# Altium project Whitespace_Daughtercard_r4.PrjPcb (part 2 of 2)

## Sheet Whitespace_Daughtercard_uhf.SchDoc: UHF 470-800 MHz Matching, PA Chain, TX/RX Switching
size D; Author: Ryan E. Guerra; Revision: 1.5; SheetNumber: 7; SheetTotal: 10
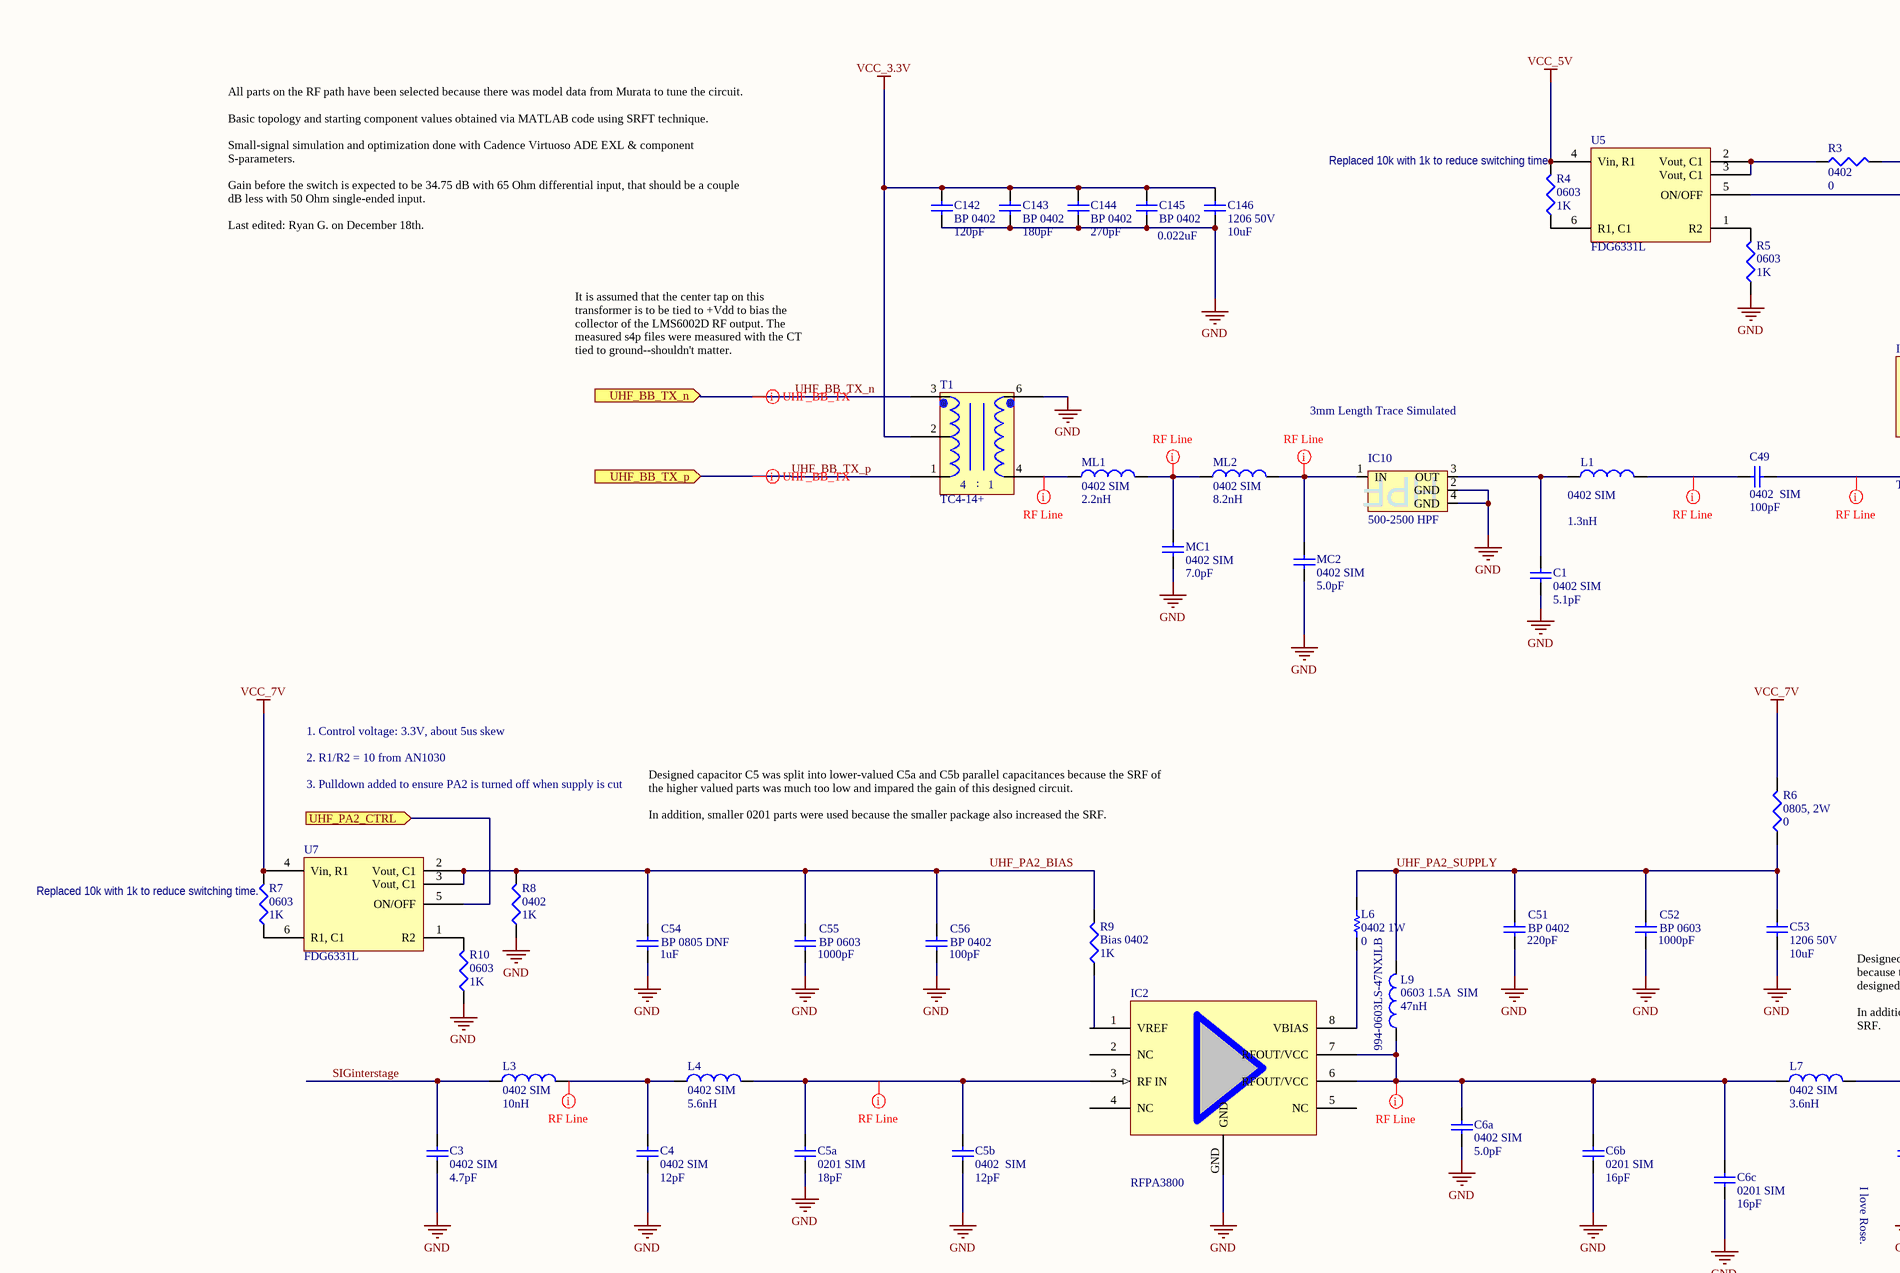
[diagram p8: Whitespace_Daughtercard_uhf.SchDoc, top left]
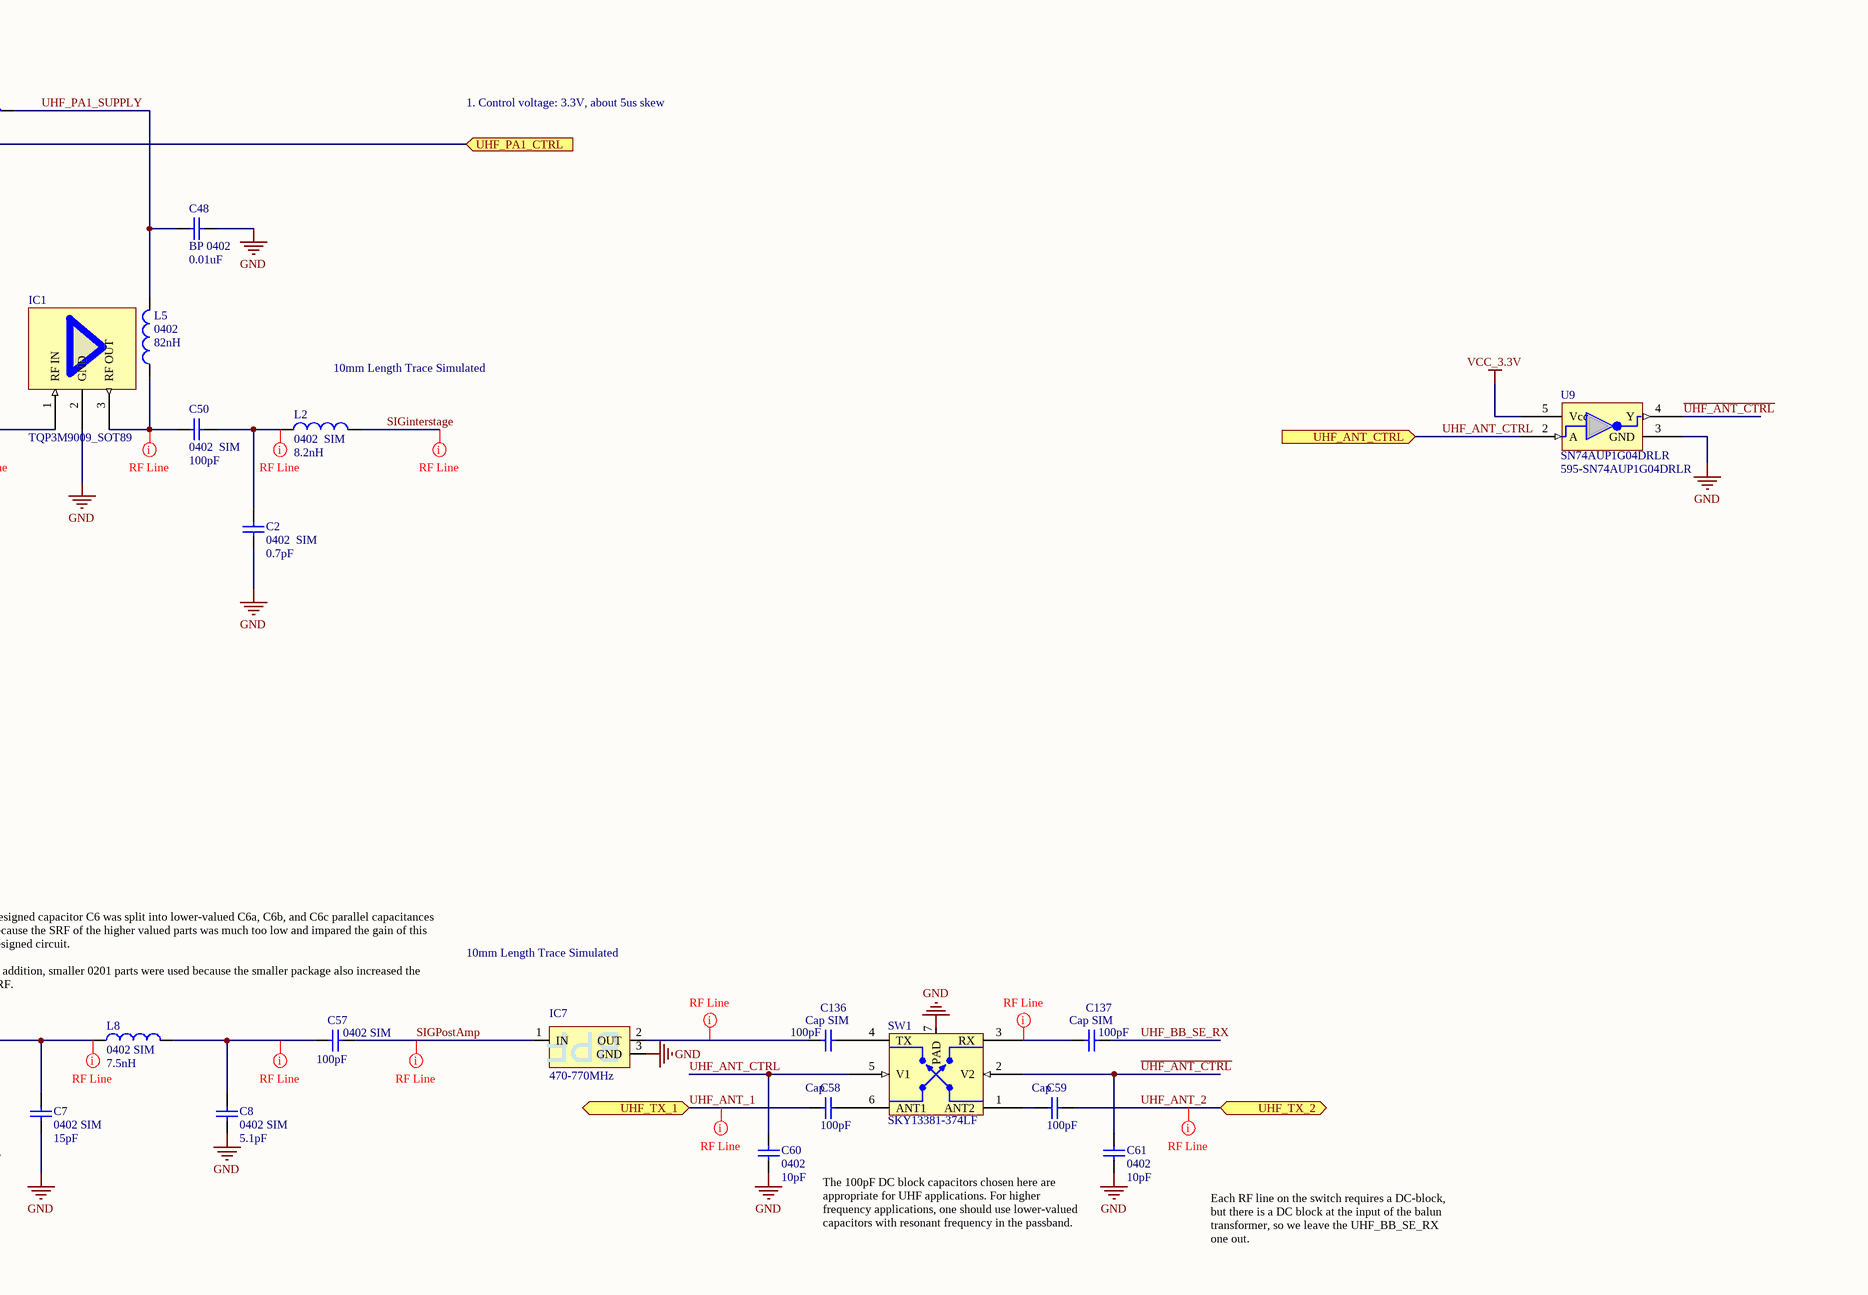
[diagram p9: Whitespace_Daughtercard_uhf.SchDoc, top right]
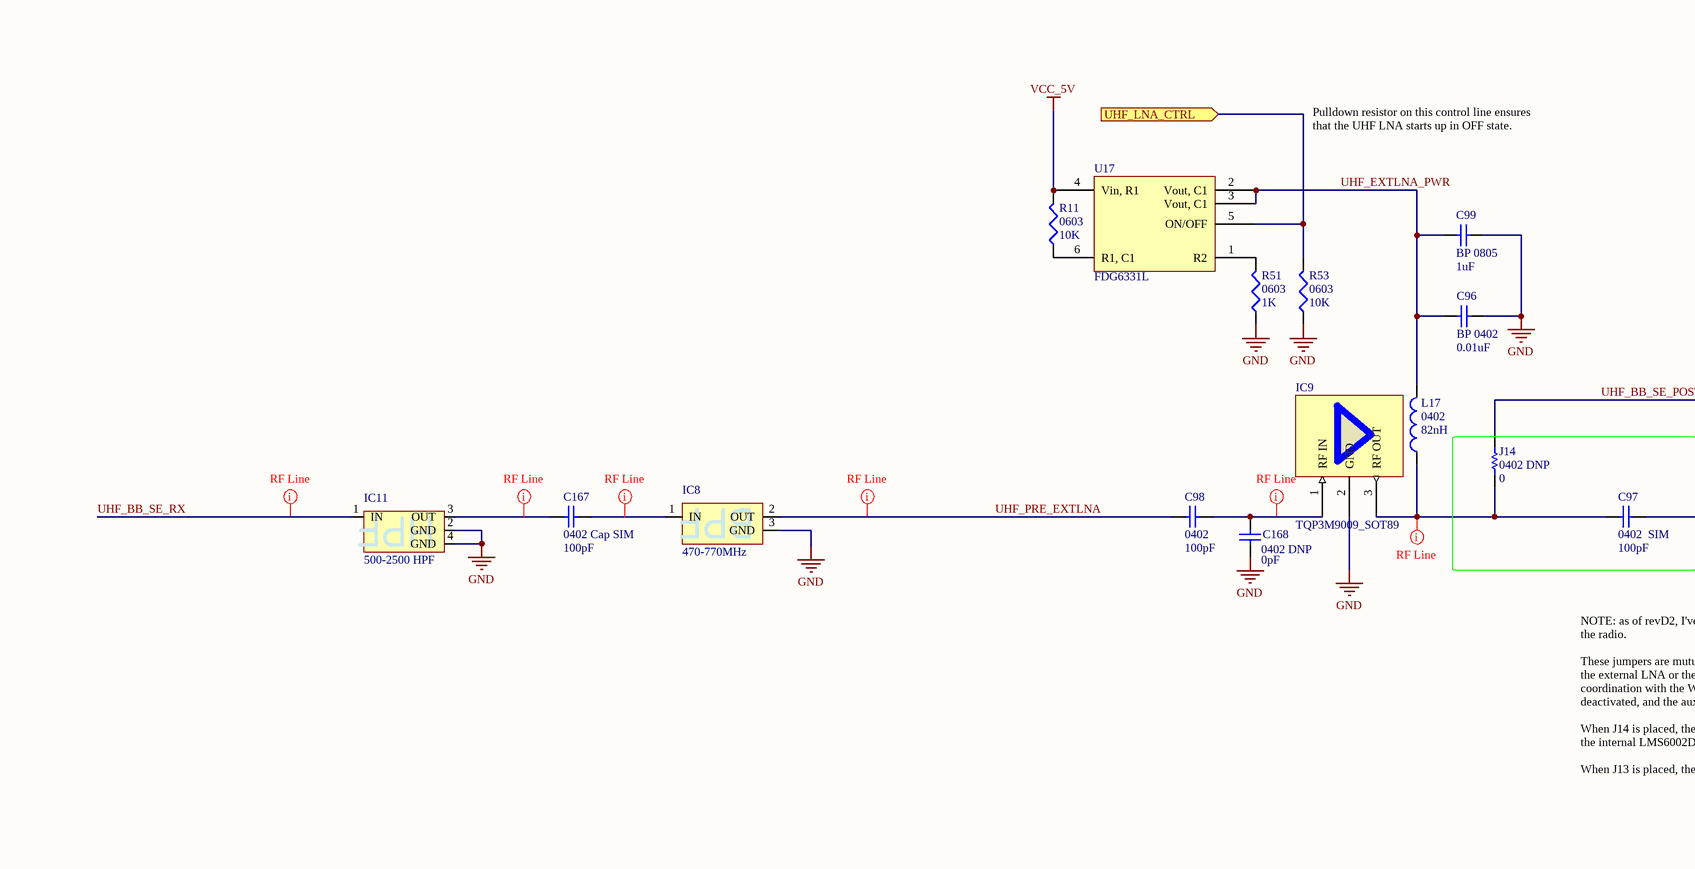
[diagram p10: Whitespace_Daughtercard_uhf.SchDoc, bottom left]
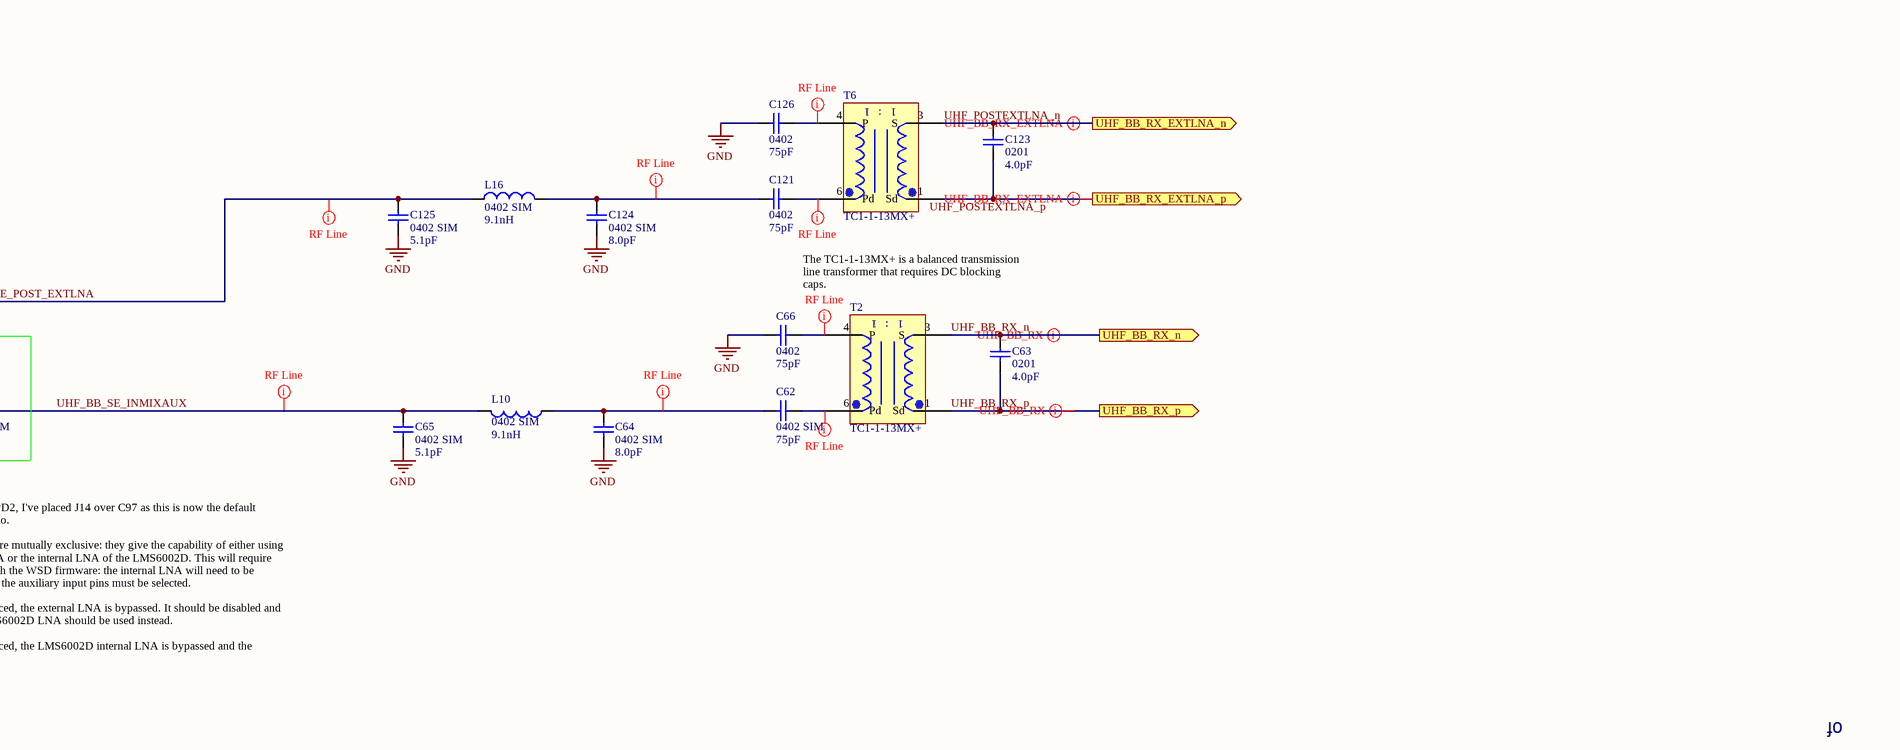
[diagram p11: Whitespace_Daughtercard_uhf.SchDoc, bottom right]

### Parts
C1  0402 SIM  value 5.1pF  [0402_SMT_V3]
C2  0402  SIM  value 0.7pF  [0402_SMT_V3]
C3  0402 SIM  value 4.7pF  [0402_SMT_V3]
C4  0402 SIM  value 12pF  [0402_SMT_V3]
C5a  0201 SIM  value 18pF  [0201_SMT_V3]
C5b  0402  SIM  value 12pF  [0402_SMT_V3]
C6a  0402 SIM  value 5.0pF  [0402_SMT_V3]
C6b  0201 SIM  value 16pF  [0201_SMT_V3]
C6c  0201 SIM  value 16pF  [0201_SMT_V3]
C7  0402 SIM  value 15pF  [0402_SMT_V3]
C8  0402 SIM  value 5.1pF  [0402_SMT_V3]
C48  BP 0402  value 0.01uF  [0402_SMT_V3]
C49  0402  SIM  value 100pF  [0402_SMT_V3]
C50  0402  SIM  value 100pF  [0402_SMT_V3]
C51  BP 0402  value 220pF  [0402_SMT_V3]
C52  BP 0603  value 1000pF  [0603_SMT_V3]
C53  1206 50V  value 10uF  [1206_SMT_v3]
C54  BP 0805 DNF  value 1uF  [0805_SMT_v3]
C55  BP 0603  value 1000pF  [0603_SMT_V3]
C56  BP 0402  value 100pF  [0402_SMT_V3]
C57  0402 SIM  value 100pF  [0402_SMT_V3]
C58  Cap  value 100pF  [0402_SMT_V3]
C59  Cap  value 100pF  [0402_SMT_V3]
C60  0402  value 10pF  [0402_SMT_v3]
C61  0402  value 10pF  [0402_SMT_v3]
C62  0402 SIM  value 75pF  [0402_SMT_v3]
C63  0201  value 4.0pF  [0201_SMT_v3]
C64  0402 SIM  value 8.0pF  [0402_SMT_v3]
C65  0402 SIM  value 5.1pF  [0402_SMT_v3]
C66  0402  value 75pF  [0402_SMT_v3]
C96  BP 0402  value 0.01uF  [0402_SMT_V3]
C97  0402  SIM  value 100pF  [0402_SMT_V3]
C98  0402  value 100pF  [0402_SMT_V3]
C99  BP 0805  value 1uF  [0805_SMT_v3]
C121  0402  value 75pF  [0402_SMT_v3]
C123  0201  value 4.0pF  [0201_SMT_v3]
C124  0402 SIM  value 8.0pF  [0402_SMT_v3]
C125  0402 SIM  value 5.1pF  [0402_SMT_v3]
C126  0402  value 75pF  [0402_SMT_v3]
C136  Cap SIM  value 100pF  [0402_SMT_V3]
C137  Cap SIM  value 100pF  [0402_SMT_V3]
C142  BP 0402  value 120pF  [0402_SMT_v3]
C143  BP 0402  value 180pF  [0402_SMT_v3]
C144  BP 0402  value 270pF  [0402_SMT_v3]
C145  BP 0402  value 0.022uF  [0402_SMT_V3]
C146  1206 50V  value 10uF  [1206_SMT_v3]
C167  0402 Cap SIM  value 100pF  [0402_SMT_V3]
C168  0402 DNP  value 0pF  [0402_SMT_v3]
IC1  TQP3M9009_SOT89  [TQP3M9009_SOT-89_v6]
IC2  RFPA3800  [RFPA3800_SOIC-8_v2]
IC7  470-770MHz  [FI168B/L Taido Yuden]
IC8  470-770MHz  [FI168B/L Taido Yuden]
IC9  TQP3M9009_SOT89  [TQP3M9009_SOT-89_v6]
IC10  500-2500 HPF  [HFCN-440+_v2]
IC11  500-2500 HPF  [HFCN-440+_v2]
J14  0402 DNP  value 0  [0402_SMT_v3]
L1  0402 SIM  value 1.3nH  [0402_SMT_V3]
L2  0402  SIM  value 8.2nH  [0402_SMT_V3]
L3  0402 SIM  value 10nH  [0402_SMT_V3]
L4  0402 SIM  value 5.6nH  [0402_SMT_V3]
L5  0402  value 82nH  [0402_SMT_V3]
L6  0402 1W  value 0  [0402_SMT_v3]
L7  0402 SIM  value 3.6nH  [0402_SMT_V3]
L8  0402 SIM  value 7.5nH  [0402_SMT_V3]
L9  0603 1.5A  SIM  value 47nH  Supplier Part Number 1: 994-0603LS-47NXJLB  [0603_SMT_v3]
L10  0402 SIM  value 9.1nH  [0402_SMT_v3]
L16  0402 SIM  value 9.1nH  [0402_SMT_v3]
L17  0402  value 82nH  [0402_SMT_V3]
MC1  0402 SIM  value 7.0pF  [0402_SMT_V3]
MC2  0402 SIM  value 5.0pF  [0402_SMT_V3]
ML1  0402 SIM  value 2.2nH  [0402_SMT_V3]
ML2  0402 SIM  value 8.2nH  [0402_SMT_V3]
R3  0402  value 0  [0402_SMT_V3]
R4  0603  value 1K  [0603_SMT_v3]
R5  0603  value 1K  [0603_SMT_v3]
R6  0805, 2W  value 0  [0805_SMT_v3]
R7  0603  value 1K  [0603_SMT_v3]
R8  0402  value 1K  [0402_SMT_V3]
R9  Bias 0402  value 1K  [0402_SMT_V3]
R10  0603  value 1K  [0603_SMT_v3]
R11  0603  value 10K  [0603_SMT_v3]
R51  0603  value 1K  [0603_SMT_v3]
R53  0603  value 10K  [0603_SMT_v3]
SW1  SKY13381-374LF  [SKY13381-374LF_v6]
T1  TC4-14+  [AT224-1_V2]
T2  TC1-1-13MX+  [AT1521_MiniCircuits]
T6  TC1-1-13MX+  [AT1521_MiniCircuits]
U5  FDG6331L  [SC-70-6]
U7  FDG6331L  [SC-70-6]
U9  SN74AUP1G04DRLR  Supplier Part Number 1: 595-SN74AUP1G04DRLR  [DRL_R-PDSO-N5_v2]
U17  FDG6331L  [SC-70-6]

### Ports
UHF_ANT_CTRL (in), UHF_BB_RX_EXTLNA_n (out), UHF_BB_RX_EXTLNA_p (out), UHF_BB_RX_n (out), UHF_BB_RX_p (out), UHF_BB_TX_n (in), UHF_BB_TX_p (in), UHF_LNA_CTRL (in), UHF_PA1_CTRL (in), UHF_PA2_CTRL (in), UHF_TX_1 (bidir), UHF_TX_2 (bidir)

### Nets
GND: C1.1 C2.1 C3.1 C4.1 C5a.1 C5b.1 C6a.1 C6b.1 C6c.1 C7.1 C8.1 C48.2 C51.1 C52.1 C53.2 C54.1 C55.1 C56.1 C60.1 C61.1 C64.1 C65.2 C66.2 C96.2 C99.1 C124.1 C125.1 C126.2 C142.1 C143.2 C144.2 C145.1 C146.1 C168.1 IC1.2(GND) IC2.GND IC7.3(GND) IC8.3(GND) IC9.2(GND) IC10.2(GND) IC10.4(GND) IC11.2(GND) IC11.4(GND) MC1.1 MC2.1 R5.1 R8.1 R10.1 R51.1 R53.1 SW1.7(PAD) T1.6(P_DOT) U9.3(GND)
VCC_3.3V: C142.2 C143.1 C144.1 C145.2 C146.2 T1.2(S_CT) U9.5(Vcc)
VCC_5V: R4.2 R11.2 U5.4(Vin,_R1) U17.4(Vin,_R1)
VCC_7V: R6.2 R7.2 U7.4(Vin,_R1)
~{UHF_ANT_CTRL}: C61.2 SW1.2(V2) U9.4(Y)  [project net ~{UHF_ANT_CTRL_7}]
PB5: R53.2 U17.5(ON/OFF) ; port UHF_LNA_CTRL
PE4: U5.5(ON/OFF) ; port UHF_PA1_CTRL
SIGinterstage: C3.2 L2.2 L3.1  [project net SIGinterstage_7]
SIGPostAmp: C57.2 IC7.1(IN)  [project net SIGPostAmp_7]
UHF_ANT_1: C58.2 ; port UHF_TX_1
UHF_ANT_2: C59.1 ; port UHF_TX_2
UHF_ANT_CTRL: C60.2 SW1.5(V1) U9.2(A) ; port UHF_ANT_CTRL
UHF_BB_RX_n: C63.1 T2.3(S) ; port UHF_BB_RX_n
UHF_BB_RX_p: C63.2 T2.1(Sd) ; port UHF_BB_RX_p
UHF_BB_SE_INMIXAUX: C65.1 C97.1 L10.2  [project net UHF_BB_SE_INMIXAUX_7]
UHF_BB_SE_POST_EXTLNA: C125.2 J14.2 L16.1  [project net UHF_BB_SE_POST_EXTLNA_7]
UHF_BB_SE_RX: C137.1 IC11.1(IN)  [project net UHF_BB_SE_RX_7]
UHF_BB_TX_n: T1.3(S_DOT) ; port UHF_BB_TX_n
UHF_BB_TX_p: T1.1(S) ; port UHF_BB_TX_p
UHF_EXTLNA_PWR: C96.1 C99.2 L17.2 U17.2(Vout,_C1) U17.3(Vout,_C1)  [project net UHF_EXTLNA_PWR_7]
UHF_PA1_SUPPLY: C48.1 L5.2 R3.2  [project net UHF_PA1_SUPPLY_7]
UHF_PA2_BIAS: C54.2 C55.2 C56.2 R8.2 R9.2 U7.2(Vout,_C1) U7.3(Vout,_C1)  [project net UHF_PA2_BIAS_7]
UHF_PA2_CTRL: U7.5(ON/OFF) ; port UHF_PA2_CTRL
UHF_PA2_SUPPLY: C51.2 C52.2 C53.1 L6.2 L9.2 R6.1  [project net UHF_PA2_SUPPLY_7]
UHF_POSTEXTLNA_n: C123.1 T6.3(S) ; port UHF_BB_RX_EXTLNA_n
UHF_POSTEXTLNA_p: C123.2 T6.1(Sd) ; port UHF_BB_RX_EXTLNA_p
UHF_PRE_EXTLNA: C98.2 IC8.2(OUT)  [project net UHF_PRE_EXTLNA_7]
NetC1_2: C1.2 IC10.3(OUT) L1.1
NetC2_2: C2.2 C50.2 L2.1
NetC4_2: C4.2 L3.2 L4.1
NetC5a_2: C5a.2 C5b.2 IC2.3(RF_IN) L4.2
NetC6a_2: C6a.2 C6b.2 C6c.2 IC2.6(RFOUT/VCC) IC2.7(RFOUT/VCC) L7.1 L9.1
NetC7_2: C7.2 L7.2 L8.1
NetC8_2: C8.2 C57.1 L8.2
NetC49_1: C49.1 L1.2
NetC49_2: C49.2 IC1.1(RF_IN)
NetC50_1: C50.1 IC1.3(RF_OUT) L5.1
NetC58_1: C58.1 SW1.6(ANT1)
NetC59_2: C59.2 SW1.1(ANT2)
NetC62_1: C62.1 T2.6(Pd)
NetC62_2: C62.2 C64.2 L10.1
NetC66_1: C66.1 T2.4(P)
NetC97_2: C97.2 IC9.3(RF_OUT) J14.1 L17.1
NetC98_1: C98.1 C168.2 IC9.1(RF_IN)
NetC121_1: C121.1 T6.6(Pd)
NetC121_2: C121.2 C124.2 L16.2
NetC126_1: C126.1 T6.4(P)
NetC136_1: C136.1 SW1.4(TX)
NetC136_2: C136.2 IC7.2(OUT)
NetC137_2: C137.2 SW1.3(RX)
NetC167_1: C167.1 IC11.3(OUT)
NetC167_2: C167.2 IC8.1(IN)
NetIC2_1: IC2.1(VREF) R9.1
NetIC2_8: IC2.8(VBIAS) L6.1
NetIC10_1: IC10.1(IN) MC2.2 ML2.2
NetMC1_2: MC1.2 ML1.2 ML2.1
NetML1_1: ML1.1 T1.4(P)
NetR3_1: R3.1 U5.2(Vout,_C1) U5.3(Vout,_C1)
NetR4_1: R4.1 U5.6(R1,_C1)
NetR5_2: R5.2 U5.1(R2)
NetR7_1: R7.1 U7.6(R1,_C1)
NetR10_2: R10.2 U7.1(R2)
NetR11_1: R11.1 U17.6(R1,_C1)
NetR51_2: R51.2 U17.1(R2)

Not connected (* = marked no-connect by the designer): IC2 2(NC) 4(NC) 5(NC)

### Layout directives
differential pair: UHF_BB_RX_n, UHF_BB_RX_p, UHF_BB_TX_n, UHF_BB_TX_p, UHF_POSTEXTLNA_n, UHF_POSTEXTLNA_p
rule Impedance Constraint [Min = 49.00    Max = 51.00    ]; net class RF: NetC2_2, NetC4_2, NetC5a_2, NetC6a_2, NetC7_2, NetC8_2, NetC49_1, NetC49_2, NetC50_1, NetC62_1, NetC62_2, NetC66_1, NetC97_2, NetC98_1, NetC121_1, NetC121_2, NetC126_1, NetC136_2, NetC137_2, NetC167_1, NetC167_2, NetIC10_1, NetMC1_2, NetML1_1, SIGinterstage_7, SIGPostAmp_7, UHF_ANT_1, UHF_ANT_2, UHF_BB_SE_INMIXAUX_7, UHF_BB_SE_POST_EXTLNA_7, UHF_BB_SE_RX_7, UHF_PRE_EXTLNA_7

### Notes on the sheet
- (near U5) Replaced 10k with 1k to reduce switching time.
- 1. Control voltage: 3.3V, about 5us skew
- All parts on the RF path have been selected because there was model data from Murata to tune the circuit.
  Basic topology and starting component values obtained via MATLAB code using SRFT technique.
  Small-signal simulation and optimization done with Cadence Virtuoso ADE EXL & component S-parameters.
  Gain before the switch is expected to be 34.75 dB with 65 Ohm differential input, that should be a couple dB less with 50 Ohm single-ended input.
  Last edited: Ryan G. on December 18th.
- It is assumed that the center tap on this transformer is to be tied to +Vdd to bias the collector of the LMS6002D RF output. The measured s4p files were measured with the CT tied to ground--shouldn't matter.
- 3mm Length Trace Simulated
- (near L2) 10mm Length Trace Simulated
- 2. R1/R2 = 10 from AN1030
- 3. Pulldown added to ensure PA2 is turned off when supply is cut
- Designed capacitor C5 was split into lower-valued C5a and C5b parallel capacitances because the SRF of the higher valued parts was much too low and impared the gain of this designed circuit.
  In addition, smaller 0201 parts were used because the smaller package also increased the SRF.
- Replaced 10k with 1k to reduce switching time.
- 10mm Length Trace Simulated
- Designed capacitor C6 was split into lower-valued C6a, C6b, and C6c parallel capacitances because the SRF of the higher valued parts was much too low and impared the gain of this designed circuit.
  In addition, smaller 0201 parts were used because the smaller package also increased the SRF.
- (near C7) I love Rose.
- (near C61) The 100pF DC block capacitors chosen here are appropriate for UHF applications. For higher frequency applications, one should use lower-valued capacitors with resonant frequency in the passband.
- Each RF line on the switch requires a DC-block, but there is a DC block at the input of the balun transformer, so we leave the UHF_BB_SE_RX one out.
- Pulldown resistor on this control line ensures that the UHF LNA starts up in OFF state.
- The TC1-1-13MX+ is a balanced transmission line transformer that requires DC blocking caps.
- NOTE: as of revD2, I've placed J14 over C97 as this is now the default mode of the radio.
  These jumpers are mutually exclusive: they give the capability of either using the external LNA or the internal LNA of the LMS6002D. This will require coordination with the WSD firmware: the internal LNA will need to be deactivated, and the auxiliary input pins must be selected.
  When J14 is placed, the external LNA is bypassed. It should be disabled and the internal LMS6002D LNA should be used instead.
  When J13 is placed, the LMS6002D internal LNA is bypassed and the external LNA should be enabled by bringing PB5 on the Stellaris high.
- of
- (in symbol FI168L062005-T) BPF
- (in symbol HFCN-440+) HPF
- (in symbol TC1-1-13MX+) :
- (in symbol TC4-14+) :

### Library data of the parts
C1-C4 C5a C5b C6a C6b C6c C7 C8 C60-C66 C121 C123-C126 MC2 = Cap Semi: Capacitor (Semiconductor SIM Model); Published: 8-Jun-2000; LatestRevisionDate: 29-May-2009; LatestRevisionNote: IPC-7351 Footprint Added.; PackageReference: C1206; Publisher: Altium Limited; PackageDescription: Chip Capacitor; Supplier 1: Mouser
  C1 C8 C65 C125: Supplier Part Number 1: 81-GRM1555C1H5R1WA1D
  C2: Supplier Part Number 1: 81-GRM1555C1HR70WA1D
  C3: Supplier Part Number 1: 81-GRM1555C1H4R7WA1D
  C4 C5b: Supplier Part Number 1: 81-GJM1555C1H120FB1D
  C5a: Supplier Part Number 1: 81-GRM0335C1H180GA1D
  C6a: Supplier Part Number 1: 81-GJM1555C1H5R0BB01
  C6b C6c: Supplier Part Number 1: 81-GRM0335C1H160GA1D
  C7: Supplier Part Number 1: 81-GJM1555C1H150GB01
  C60 C61: Supplier Part Number 1: 81-GRM1555C1H100JA1D
  C62 C66 C121 C126: Supplier Part Number 1: 81-GRM1555C1H750GZ1D
  C63 C123: Supplier Part Number 1: 81-GRM0335C1H4R0CD1D
  C64 C124: Supplier Part Number 1: 81-GRM1555C1H8R0BZ1D
  MC2: Supplier Part Number 1: 81-GRM1555C1H5R0WA1D
C48-C59 C96-C99 C136 C137 C142-C146 C167 MC1 = Cap: Capacitor; Published: 8-Jun-2000; LatestRevisionDate: 17-Jul-2002; LatestRevisionNote: Re-released for DXP Platform.; PackageReference: RAD-0.3; Publisher: Altium Limited; PackageDescription: Radial Cap, Thru-Hole; 2 Leads; 0.3 in Pin Spacing; Supplier 1: Mouser
  C48 C96: Supplier Part Number 1: 81-GRM155R71H103KA8D
  C49 C50 C56-C59 C97 C98 C136 C137 C167: Supplier Part Number 1: 81-GRM1555C1H101GA1D
  C51: Supplier Part Number 1: 81-GRM1555C1H221GA1J
  C52 C55: Supplier Part Number 1: 81-GRM39X102J50D
  C53 C146: Supplier Part Number 1: 81-GRM31CR61H106KA2L
  C54 C99: Supplier Part Number 1: 81-GRM21BR71H105KA2L
  C142: Supplier Part Number 1: 81-GRM1555C1H121GA1D
  C143: Supplier Part Number 1: 81-GRM1555C1H181GA1D
  C144: Supplier Part Number 1: 81-GRM155C1H271JA01D
  C145: Supplier Part Number 1: 81-GRM155R71H223KA2J
  MC1: Supplier Part Number 1: 81-GRM1555C1H7R0WA1D
C168 = Cap_0402: 0402 SMT Cap
IC1 IC9 = TQP3M9009_SOT89: Triquint TQP3M9009 Power Amplifier; Supplier 1: Mouser; Supplier Part Number 1: 772-TQP3M9009
IC2 = RFPA3800: RFMD RFPA3800 Power Amplifier
IC7 IC8 = FI168L062005-T: Supplier 1: Mouser; Supplier Part Number 1: 963-FI168L062005-T
IC10 IC11 = HFCN-440+: Mini-Circuits High-Pass 500-2500 MHz Filter SMT
J14 L6 = Res_0402: 0402 SMT Resistor; Supplier Part Number 1: 660-RK73Z1ETTP; Supplier 1: Mouser
L1-L5 L7-L10 L16 L17 ML1 ML2 = Inductor: Code_IEC: 1005; Published: 8-Jun-2000; LatestRevisionDate: 29-May-2009; LatestRevisionNote: IPC-7351 Footprint Added.; PackageReference: 0402-A; Publisher: Altium Limited; PackageDescription: Chip Inductor; Code_JEITA: 0402; Supplier 1: Mouser
  L1: Supplier Part Number 1: 81-LQP15MN1N3W02D
  L2 ML2: Supplier Part Number 1: 81-LQP15MN8N2B02D
  L3: Supplier Part Number 1: 81-LQP15MN10NG02D
  L4: Supplier Part Number 1: 81-LQP15MN5N6B02D
  L5 L17: Supplier Part Number 1: 81-LQW15AN82NJ00D
  L7: Supplier Part Number 1: 81-LQP15MN3N6W02D
  L8: Supplier Part Number 1: 81-LQP15MN7N5B02D
  L10 L16: Supplier Part Number 1: 81-LQP15MN9N1B02D
  ML1: Supplier Part Number 1: 81-LQP15MN2N2W02D
R3-R11 R51 R53 = Res3: Resistor; Published: 8-Jun-2000; LatestRevisionDate: 29-May-2009; LatestRevisionNote: IPC-7351 Footprint Added.; PackageReference: J1-0603; Publisher: Altium Limited; PackageDescription: Chip Resistor; Supplier 1: Mouser
  R3: Supplier Part Number 1: 660-RK73Z1ETTP
  R4 R5 R7 R10 R51: Supplier Part Number 1: 71-CRCW0603J-1.0K
  R6: Supplier Part Number 1: 660-RK73Z2ATTED
  R8 R9: Supplier Part Number 1: 754-RR0510P-102D
  R11 R53: Supplier Part Number 1: 71-CRCW0603J-10K
SW1 = SKY13381-374LF: GaAs pHEMT DPDT switch 0.1-6.0 GHz; Supplier 1: Mouser; Supplier Part Number 1: 873-SKY13381-374LF
T1 = TC4-14+: Mini-Circuits Type A Transformer, 4:1 Ohm, CT, 200-1400MHz; Manufacturer: Mini-Circuits; Supplier 1: Mini-Circuits; Supplier Part Number 1: TC4-14X+
T2 T6 = TC1-1-13MX+: Mini-Circuits Type G 4.5-3000MHz 1:1 Transformer
U5 U7 U17 = FDG6331L: Integrated Load Switch, 0.8A, 2.5-8V, SC70-6; Supplier 1: Mouser; Supplier Part Number 1: 512-FDG6331L
U9 = SN74AUP1G04DRLR: Inverters Lo Pwr Sngl Invter Gate; Supplier 1: Mouser

## Sheet Whitespace_Daughtercard_wifi.SchDoc: Wifi 2.4GHz Matching, PA Chain, TX/RX Switching
size A3; Author: Ryan E. Guerra; Revision: 1.1; SheetNumber: 8; SheetTotal: 10
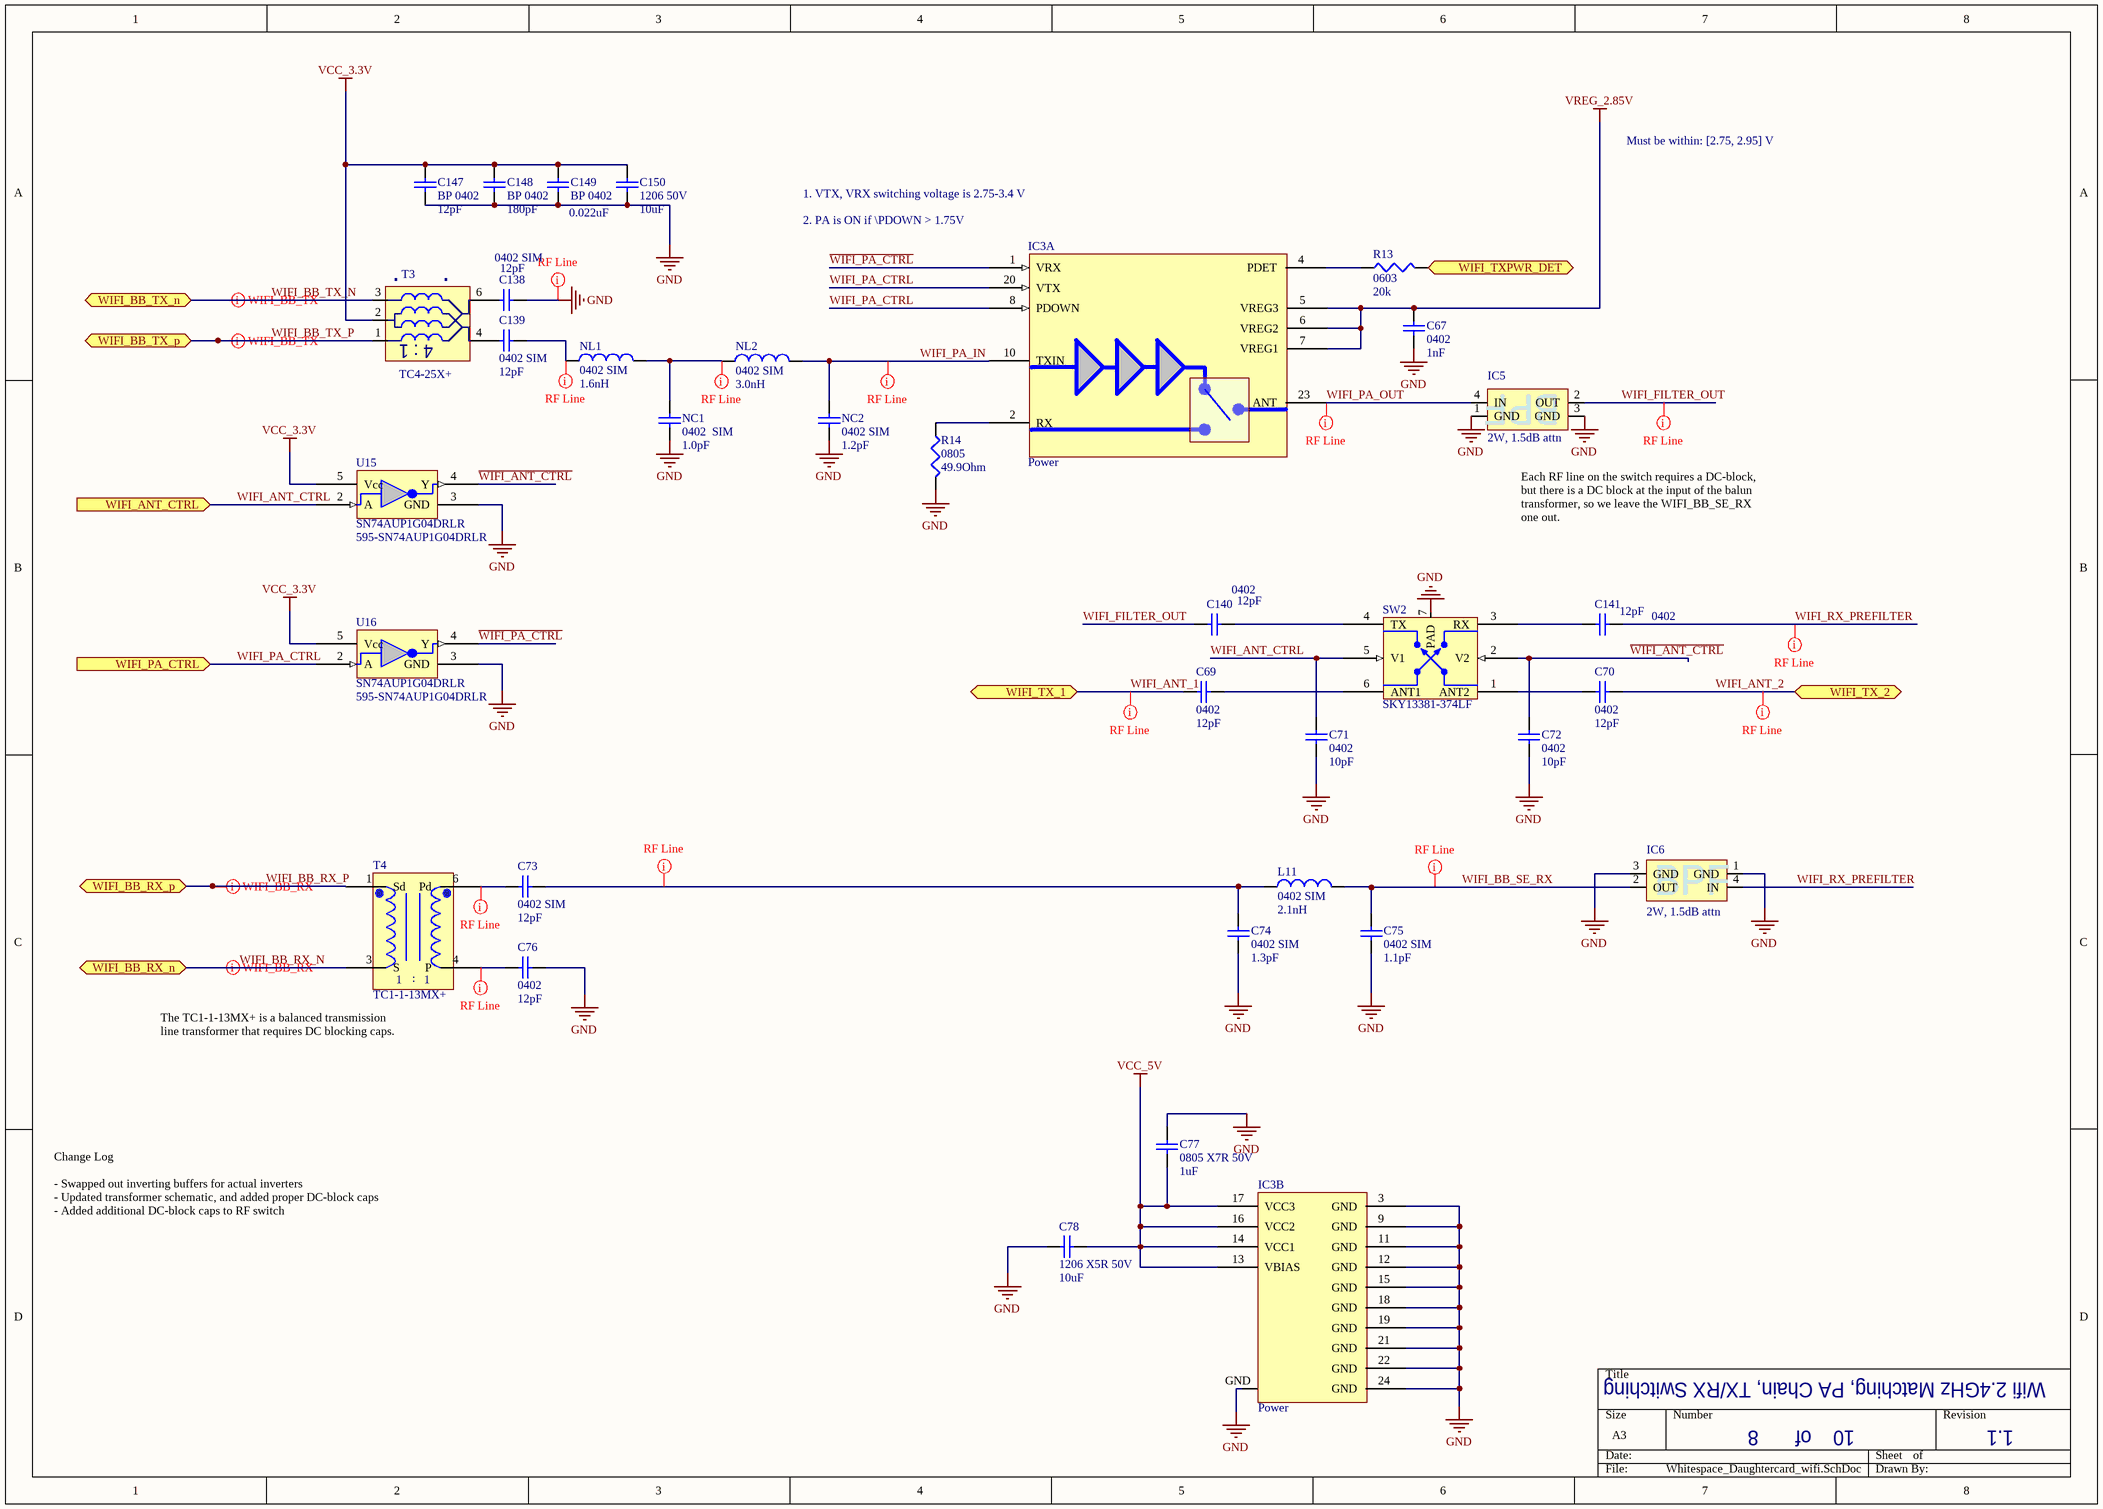
[diagram p12: Whitespace_Daughtercard_wifi.SchDoc]

### Parts
C67  0402  value 1nF  [0402_SMT_v3]
C69  0402  value 12pF  [0402_SMT_v3]
C70  0402  value 12pF  [0402_SMT_v3]
C71  0402  value 10pF  [0402_SMT_v3]
C72  0402  value 10pF  [0402_SMT_v3]
C73  0402 SIM  value 12pF  [0402_SMT_v3]
C74  0402 SIM  value 1.3pF  [0402_SMT_v3]
C75  0402 SIM  value 1.1pF  [0402_SMT_v3]
C76  0402  value 12pF  [0402_SMT_v3]
C77  0805 X7R 50V  value 1uF  [0805_SMT_v3]
C78  1206 X5R 50V  value 10uF  [1206_SMT_v3]
C138  0402 SIM  value 12pF  [0402_SMT_v3]
C139  0402 SIM  value 12pF  [0402_SMT_v3]
C140  0402  value 12pF  [0402_SMT_v3]
C141  0402  value 12pF  [0402_SMT_v3]
C147  BP 0402  value 12pF  [0402_SMT_v3]
C148  BP 0402  value 180pF  [0402_SMT_v3]
C149  BP 0402  value 0.022uF  [0402_SMT_V3]
C150  1206 50V  value 10uF  [1206_SMT_v3]
IC3  Power  [RFFM4202]  (parts A,B of 2)
IC5  2W, 1.5dB attn  [2450BP15E0100]
IC6  2W, 1.5dB attn  [2450BP15E0100]
L11  0402 SIM  value 2.1nH  [0402_SMT_v3]
NC1  0402  SIM  value 1.0pF  [0402_SMT_v3]
NC2  0402 SIM  value 1.2pF  [0402_SMT_v3]
NL1  0402 SIM  value 1.6nH  [0402_SMT_v3]
NL2  0402 SIM  value 3.0nH  [0402_SMT_v3]
R13  0603  value 20k  [0603_SMT_v3]
R14  0805  value 49.9Ohm  [0805_SMT_v3]
SW2  SKY13381-374LF  [SKY13381-374LF_v6]
T3  TC4-25X+  [AT224-1_V2]
T4  TC1-1-13MX+  [AT1521_MiniCircuits]
U15  SN74AUP1G04DRLR  Supplier Part Number 1: 595-SN74AUP1G04DRLR  [DRL_R-PDSO-N5_v2]
U16  SN74AUP1G04DRLR  Supplier Part Number 1: 595-SN74AUP1G04DRLR  [DRL_R-PDSO-N5_v2]

### Ports
WIFI_ANT_CTRL (in), WIFI_BB_RX_n, WIFI_BB_RX_p, WIFI_BB_TX_n, WIFI_BB_TX_p, WIFI_PA_CTRL (in), WIFI_TX_1, WIFI_TX_2, WIFI_TXPWR_DET (out)

### Nets
GND: C67.1 C71.1 C72.1 C74.1 C75.1 C76.2 C77.2 C78.1 C138.1 C147.1 C148.2 C149.1 C150.1 IC3.3(GND) IC3.9(GND) IC3.11(GND) IC3.12(GND) IC3.15(GND) IC3.18(GND) IC3.19(GND) IC3.21(GND) IC3.22(GND) IC3.24(GND) IC3.GND(GND_PAD) IC5.1(GND) IC5.3(GND) IC6.1(GND) IC6.3(GND) NC1.1 NC2.1 R14.2 SW2.7(PAD) U15.3(GND) U16.3(GND)
VCC_3.3V: C147.2 C148.1 C149.2 C150.2 T3.2(S_CT) U15.5(Vcc) U16.5(Vcc)
VCC_5V: C77.1 C78.2 IC3.13(VBIAS) IC3.14(VCC1) IC3.16(VCC2) IC3.17(VCC3)
VREG_2.85V: C67.2 IC3.5(VREG3) IC3.6(VREG2) IC3.7(VREG1)
~{WIFI_ANT_CTRL}: C72.2 SW2.2(V2) U15.4(Y)  [project net ~{WIFI_ANT_CTRL_8}]
~{WIFI_PA_CTRL}: IC3.1(VRX) U16.4(Y)  [project net ~{WIFI_PA_CTRL_8}]
PD2: R13.2 ; port WIFI_TXPWR_DET
WIFI_ANT_1: C69.2 ; port WIFI_TX_1
WIFI_ANT_2: C70.2 ; port WIFI_TX_2
WIFI_ANT_CTRL: C71.2 SW2.5(V1) U15.2(A) ; port WIFI_ANT_CTRL
WIFI_BB_RX_N: T4.3(S) ; port WIFI_BB_RX_n
WIFI_BB_RX_P: T4.1(Sd) ; port WIFI_BB_RX_p
WIFI_BB_SE_RX: C75.2 IC6.2(OUT) L11.2  [project net WIFI_BB_SE_RX_8]
WIFI_BB_TX_N: T3.3(S_DOT) ; port WIFI_BB_TX_n
WIFI_BB_TX_P: T3.1(S) ; port WIFI_BB_TX_p
WIFI_FILTER_OUT: C140.1 IC5.2(OUT)  [project net WIFI_FILTER_OUT_8]
WIFI_PA_CTRL: IC3.8(PDOWN) IC3.20(VTX) U16.2(A) ; port WIFI_PA_CTRL
WIFI_PA_IN: IC3.10(TXIN) NC2.2 NL2.2  [project net WIFI_PA_IN_8]
WIFI_PA_OUT: IC3.23(ANT) IC5.4(IN)  [project net WIFI_PA_OUT_8]
WIFI_RX_PREFILTER: C141.2 IC6.4(IN)  [project net WIFI_RX_PREFILTER_8]
NetC69_1: C69.1 SW2.6(ANT1)
NetC70_1: C70.1 SW2.1(ANT2)
NetC73_1: C73.1 T4.6(Pd)
NetC73_2: C73.2 C74.2 L11.1
NetC76_1: C76.1 T4.4(P)
NetC138_2: C138.2 T3.6(P_DOT)
NetC139_1: C139.1 NL1.1
NetC139_2: C139.2 T3.4(P)
NetC140_2: C140.2 SW2.4(TX)
NetC141_1: C141.1 SW2.3(RX)
NetIC3_2: IC3.2(RX) R14.1
NetIC3_4: IC3.4(PDET) R13.1
NetNC1_2: NC1.2 NL1.2 NL2.1

### Layout directives
differential pair: WIFI_BB_RX_N, WIFI_BB_RX_P, WIFI_BB_TX_N, WIFI_BB_TX_P
rule Impedance Constraint [Min = 49.00    Max = 51.00    ]; net class RF: GND, NetC73_1, NetC73_2, NetC76_1, NetC139_1, NetNC1_2, WIFI_ANT_1, WIFI_ANT_2, WIFI_BB_SE_RX_8, WIFI_FILTER_OUT_8, WIFI_PA_IN_8, WIFI_PA_OUT_8, WIFI_RX_PREFILTER_8

### Notes on the sheet
- Must be within: [2.75, 2.95] V
- 2. PA is ON if \PDOWN > 1.75V
- 1. VTX, VRX switching voltage is 2.75-3.4 V
- (near IC5) Each RF line on the switch requires a DC-block, but there is a DC block at the input of the balun transformer, so we leave the WIFI_BB_SE_RX one out.
- (near T4) The TC1-1-13MX+ is a balanced transmission line transformer that requires DC blocking caps.
- Change Log
  - Swapped out inverting buffers for actual inverters
  - Updated transformer schematic, and added proper DC-block caps
  - Added additional DC-block caps to RF switch
- of
- (in symbol 2450BP15E0100) BPF
- (in symbol TC1-1-13MX+) :
- (in symbol TC4-25X+) .; 4 : 1

### Library data of the parts
C67 C71-C78 NC1 NC2 = Cap Semi: Capacitor (Semiconductor SIM Model); Published: 8-Jun-2000; LatestRevisionDate: 29-May-2009; LatestRevisionNote: IPC-7351 Footprint Added.; PackageReference: C1206; Publisher: Altium Limited; PackageDescription: Chip Capacitor; Supplier 1: Mouser
  C67: Supplier Part Number 1: 81-GRM1555C1H102GA1D
  C71 C72: Supplier Part Number 1: 81-GRM1555C1H100JA1D
  C73 C76: Supplier Part Number 1: 81-GRM1555C1H120JA1D
  C74: Supplier Part Number 1: 81-GRM1555C1H1R3BA1D
  C75: Supplier Part Number 1: 81-GRM1555C1H1R1WA1D
  C77: Supplier Part Number 1: 963-UMK212B7105KG-T
  C78: Supplier Part Number 1: 81-GRM31CR61H106KA2L
  NC1: Supplier Part Number 1: 81-GRM1555C1H1R0WA1D
  NC2: Supplier Part Number 1: 81-GRM1555C1H1R2WA1D
C69 C70 C138-C141 C147-C150 = Cap: Capacitor; Published: 8-Jun-2000; LatestRevisionDate: 17-Jul-2002; LatestRevisionNote: Re-released for DXP Platform.; PackageReference: RAD-0.3; Publisher: Altium Limited; PackageDescription: Radial Cap, Thru-Hole; 2 Leads; 0.3 in Pin Spacing; Supplier 1: Mouser
  C69 C70 C138-C141 C147: Supplier Part Number 1: 81-GRM1555C1H120GA1D
  C148: Supplier Part Number 1: 81-GRM1555C1H181GA1D
  C149: Supplier Part Number 1: 81-GRM155R71H223KA2J
  C150: Supplier Part Number 1: 81-GRM31CR61H106KA2L
IC3 = RFFM4202: 5V, 2.4 to 2.5 GHz FEM w/ PA + PwrDet + SW; Manufacturer: RFMD; Supplier 1: RFMD; Supplier Part Number 1: RFFM4202
IC5 IC6 = 2450BP15E0100: Johanson 2450 MHz Band Pass Ceramic Filter 2400-2500MHz; Supplier 1: Digi-Key; Supplier Part Number 1: 712-1081-6-ND
L11 NL1 NL2 = Inductor: Code_IEC: 1005; Published: 8-Jun-2000; LatestRevisionDate: 29-May-2009; LatestRevisionNote: IPC-7351 Footprint Added.; PackageReference: 0402-A; Publisher: Altium Limited; PackageDescription: Chip Inductor; Code_JEITA: 0402; Supplier 1: Mouser
  L11: Supplier Part Number 1: 81-LQP15MN2N0W02D
  NL1: Supplier Part Number 1: 81-LQP15MN1N6W02D
  NL2: Supplier Part Number 1: 81-LQP15MN3N0W02D
R13 R14 = Res3: Resistor; Published: 8-Jun-2000; LatestRevisionDate: 29-May-2009; LatestRevisionNote: IPC-7351 Footprint Added.; PackageReference: J1-0603; Publisher: Altium Limited; PackageDescription: Chip Resistor; Supplier 1: Mouser
  R13: Supplier Part Number 1: 667-ERA-3AED203V
  R14: Supplier Part Number 1: 667-ERJ-6ENF49R9V
SW2 = SKY13381-374LF: GaAs pHEMT DPDT switch 0.1-6.0 GHz; Supplier 1: Mouser; Supplier Part Number 1: 873-SKY13381-374LF
T3 = TC4-25X+: Mini-Circuits Type A Transformer, 4:1 Ohm, CT, 500-2500MHz
T4 = TC1-1-13MX+: as T2 on sheet Whitespace_Daughtercard_uhf
U15 U16 = SN74AUP1G04DRLR: Inverters Lo Pwr Sngl Invter Gate; Supplier 1: Mouser

## Sheet Whitespace_Daughtercard_ucontroller.SchDoc: Daughtercard Microcontroller
size A3; Author: Ryan E. Guerra; Revision: 1.0; SheetNumber: 5; SheetTotal: 10
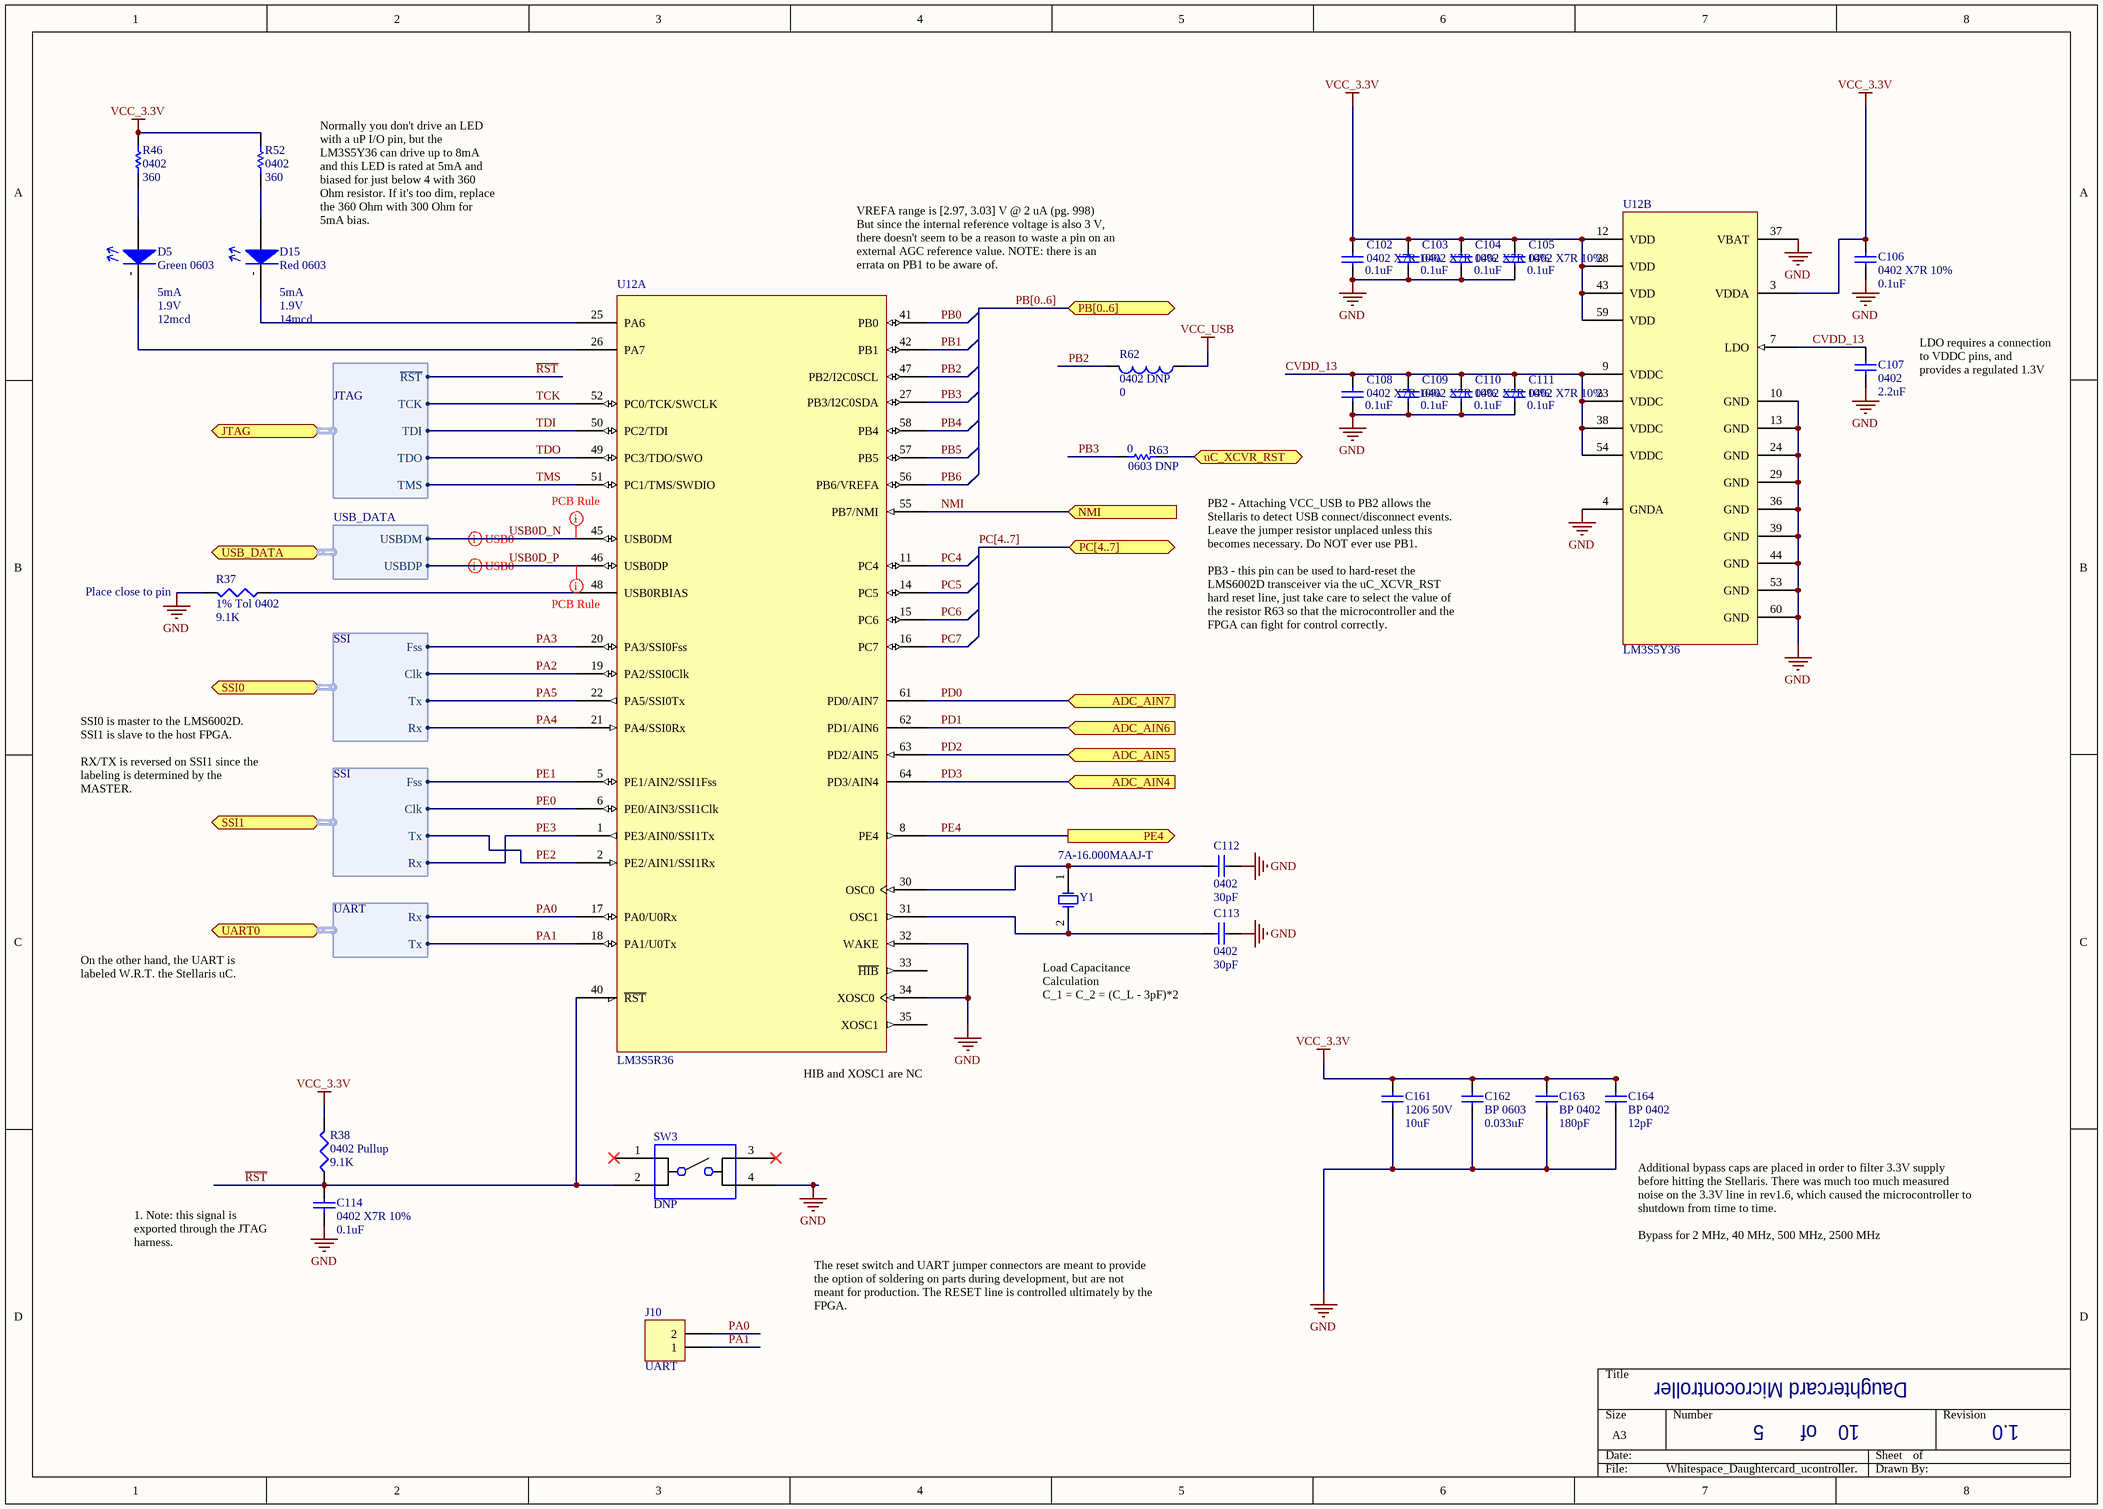
[diagram p13: Whitespace_Daughtercard_ucontroller.SchDoc]

### Parts
C102  0402 X7R 10%  value 0.1uF  [0402_SMT_V3]
C103  0402 X7R 10%  value 0.1uF  [0402_SMT_V3]
C104  0402 X7R 10%  value 0.1uF  [0402_SMT_V3]
C105  0402 X7R 10%  value 0.1uF  [0402_SMT_V3]
C106  0402 X7R 10%  value 0.1uF  [0402_SMT_V3]
C107  0402  value 2.2uF  [0402_SMT_v3]
C108  0402 X7R 10%  value 0.1uF  [0402_SMT_V3]
C109  0402 X7R 10%  value 0.1uF  [0402_SMT_V3]
C110  0402 X7R 10%  value 0.1uF  [0402_SMT_V3]
C111  0402 X7R 10%  value 0.1uF  [0402_SMT_V3]
C112  0402  value 30pF  [0402_SMT_v3]
C113  0402  value 30pF  [0402_SMT_v3]
C114  0402 X7R 10%  value 0.1uF  [0402_SMT_V3]
C161  1206 50V  value 10uF  [1206_SMT_v3]
C162  BP 0603  value 0.033uF  [0603_SMT_v3]
C163  BP 0402  value 180pF  [0402_SMT_v3]
C164  BP 0402  value 12pF  [0402_SMT_v3]
D5  Green 0603  Current: 5mA  Forward Voltage: 1.9V  Luminosity: 12mcd  [0603_POLAR]
D15  Red 0603  Current: 5mA  Forward Voltage Drop: 1.9V  Luminosity: 14mcd  [0603_POLAR]
J10  UART  [HDR1X2]
R37  1% Tol 0402  value 9.1K  [0402_SMT_v3]
R38  0402 Pullup  value 9.1K  [0402_SMT_v3]
R46  0402  value 360  [0402_SMT_v3]
R52  0402  value 360  [0402_SMT_v3]
R62  0402 DNP  value 0  [0402_SMT_V3]
R63  0603 DNP  value 0  [0603_SMT_v3]
SW3  DNP  [PUSHBUTTON_SW2_SMT]
U12  LM3S5R36  [PQFP-64-TI_Stellaris]  (parts A,B of 2)
Y1  7A-16.000MAAJ-T  [XTAL_SMT_5_3-2_v2]

### Ports
ADC_AIN4 (in), ADC_AIN5 (in), ADC_AIN6 (in), ADC_AIN7 (in), JTAG (harness JTAG), NMI (in), PB[0..6], PC[4..7], PE4 (out), SSI0 (harness SSI), SSI1 (harness SSI), UART0 (harness UART), uC_XCVR_RST, USB_DATA (harness USB_DATA)

### Harnesses
JTAG: TCK, TDI, TDO, TMS, ~{RST}
SSI: Fss, Clk, Tx, Rx
UART: Rx, Tx
USB_DATA: USBDM, USBDP

### Nets
GND: C102.1 C103.1 C104.1 C105.1 C106.2 C107.2 C108.1 C109.1 C110.1 C111.1 C112.2 C113.2 C114.2 C161.1 C162.2 C163.2 C164.2 R37.2 SW3.4 U12.4(GNDA) U12.10(GND) U12.13(GND) U12.24(GND) U12.29(GND) U12.32(WAKE) U12.34(XOSC0) U12.36(GND) U12.37(VBAT) U12.39(GND) U12.44(GND) U12.53(GND) U12.60(GND)
VCC_3.3V: C102.2 C103.2 C104.2 C105.2 C106.1 C161.2 C162.1 C163.1 C164.1 R38.2 R46.2 R52.2 U12.3(VDDA) U12.12(VDD) U12.28(VDD) U12.43(VDD) U12.59(VDD)
VCC_USB: R62.1
~{RST}: C114.1 R38.1 SW3.2 U12.40(~{RST}) ; port JTAG.~{RST}
CVDD_13: C107.1 C108.2 C109.2 C110.2 C111.2 U12.7(LDO) U12.9(VDDC) U12.23(VDDC) U12.38(VDDC) U12.54(VDDC)  [project net CVDD_13_5]
NMI: U12.55(PB7/NMI) ; port NMI
PA0: J10.2 U12.17(PA0/U0Rx) ; port UART0.Rx
PA1: J10.1 U12.18(PA1/U0Tx) ; port UART0.Tx
PA2: U12.19(PA2/SSI0Clk) ; port SSI0.Clk
PA3: U12.20(PA3/SSI0Fss) ; port SSI0.Fss
PA4: U12.21(PA4/SSI0Rx) ; port SSI0.Rx
PA5: U12.22(PA5/SSI0Tx) ; port SSI0.Tx
PB0: U12.41(PB0)
PB1: U12.42(PB1)
PB2: R62.2 U12.47(PB2/I2C0SCL)
PB3: R63.2 U12.27(PB3/I2C0SDA)
PB4: U12.58(PB4)
PB5: U12.57(PB5)
PB6: U12.56(PB6/VREFA)
PC4: U12.11(PC4)
PC5: U12.14(PC5)
PC6: U12.15(PC6)
PC7: U12.16(PC7)
PD0: U12.61(PD0/AIN7) ; port ADC_AIN7
PD1: U12.62(PD1/AIN6) ; port ADC_AIN6
PD2: U12.63(PD2/AIN5) ; port ADC_AIN5
PD3: U12.64(PD3/AIN4) ; port ADC_AIN4
PE0: U12.6(PE0/AIN3/SSI1Clk) ; port SSI1.Clk
PE1: U12.5(PE1/AIN2/SSI1Fss) ; port SSI1.Fss
PE2: U12.2(PE2/AIN1/SSI1Rx) ; port SSI1.Tx
PE3: U12.1(PE3/AIN0/SSI1Tx) ; port SSI1.Rx
PE4: U12.8(PE4) ; port PE4
TCK: U12.52(PC0/TCK/SWCLK) ; port JTAG.TCK
TDI: U12.50(PC2/TDI) ; port JTAG.TDI
TDO: U12.49(PC3/TDO/SWO) ; port JTAG.TDO
TMS: U12.51(PC1/TMS/SWDIO) ; port JTAG.TMS
TRX_RESET: R63.1 ; port uC_XCVR_RST
USB0D_N: U12.45(USB0DM) ; port USB_DATA.USBDM
USB0D_P: U12.46(USB0DP) ; port USB_DATA.USBDP
NetC112_1: C112.1 U12.30(OSC0) Y1.1(OSC1)
NetC113_1: C113.1 U12.31(OSC1) Y1.2(OSC2)
NetD5_+: D5.+(Anode) R46.1
NetD5_-: D5.-(Cathode) U12.26(PA7)
NetD15_+: D15.+(Anode) R52.1
NetD15_-: D15.-(Cathode) U12.25(PA6)
NetR37_1: R37.1 U12.48(USB0RBIAS)

Not connected (* = marked no-connect by the designer): SW3 1* 3*; U12 33(~{HIB}) 35(XOSC1)

### Buses and harness runs
bus PB[0..6] = port PB[0..6]
bus PC[4..7] = port PC[4..7]

### Layout directives
differential pair: USB0D_N, USB0D_P
rule Impedance Constraint [Min = 49.00    Max = 51.00    ]: USB0D_N, USB0D_P

### Notes on the sheet
- Normally you don't drive an LED with a uP I/O pin, but the LM3S5Y36 can drive up to 8mA and this LED is rated at 5mA and biased for just below 4 with 360 Ohm resistor. If it's too dim, replace the 360 Ohm with 300 Ohm for 5mA bias.
- (near U12) VREFA range is [2.97, 3.03] V @ 2 uA (pg. 998)
  But since the internal reference voltage is also 3 V, there doesn't seem to be a reason to waste a pin on an external AGC reference value. NOTE: there is an errata on PB1 to be aware of.
- (near C107) LDO requires a connection to VDDC pins, and provides a regulated 1.3V
- (near R37) Place close to pin
- PB2 - Attaching VCC_USB to PB2 allows the Stellaris to detect USB connect/disconnect events. Leave the jumper resistor unplaced unless this becomes necessary. Do NOT ever use PB1.
  PB3 - this pin can be used to hard-reset the LMS6002D transceiver via the uC_XCVR_RST hard reset line, just take care to select the value of the resistor R63 so that the microcontroller and the FPGA can fight for control correctly.
- SSI0 is master to the LMS6002D.
  SSI1 is slave to the host FPGA.
  RX/TX is reversed on SSI1 since the labeling is determined by the MASTER.
- On the other hand, the UART is labeled W.R.T. the Stellaris uC.
- Load Capacitance Calculation
  C_1 = C_2 = (C_L - 3pF)*2
  (TI spma036 pg. 6)
- (near U12) HIB and XOSC1 are NC
- 1. Note: this signal is exported through the JTAG harness.
- Additional bypass caps are placed in order to filter 3.3V supply before hitting the Stellaris. There was much too much measured noise on the 3.3V line in rev1.6, which caused the microcontroller to shutdown from time to time.
  Bypass for 2 MHz, 40 MHz, 500 MHz, 2500 MHz
- The reset switch and UART jumper connectors are meant to provide the option of soldering on parts during development, but are not meant for production. The RESET line is controlled ultimately by the FPGA.
- of

### Library data of the parts
C102-C106 C108-C111 C114 C161-C164 = Cap: Capacitor; Published: 8-Jun-2000; LatestRevisionDate: 17-Jul-2002; LatestRevisionNote: Re-released for DXP Platform.; PackageReference: RAD-0.3; Publisher: Altium Limited; PackageDescription: Radial Cap, Thru-Hole; 2 Leads; 0.3 in Pin Spacing; Supplier 1: Mouser
  C102-C106 C108-C111 C114: Supplier Part Number 1: 810-C1005X7R1H104K
  C161: Supplier Part Number 1: 81-GRM31CR61H106KA2L
  C162: Supplier Part Number 1: 81-GRM188R71H333KA61
  C163: Supplier Part Number 1: 81-GRM1555C1H181GA1D
  C164: Supplier Part Number 1: 81-GRM1555C1H120GA1D
C107 C112 C113 = Cap Semi: Capacitor (Semiconductor SIM Model); Published: 8-Jun-2000; LatestRevisionDate: 29-May-2009; LatestRevisionNote: IPC-7351 Footprint Added.; PackageReference: C1206; Publisher: Altium Limited; PackageDescription: Chip Capacitor; Supplier 1: Mouser
  C107: Supplier Part Number 1: 81-GRM36X222K50
  C112 C113: Supplier Part Number 1: 81-GRM1555C1H300FA1J
D5 D15 = LED: Supplier 1: Mouser
  D5: Supplier Part Number 1: 859-LTSTC193KGKT5A
  D15: Supplier Part Number 1: 859-LTSTC193KRKT5A
J10 = Header 2: Header, 2-Pin; LatestRevisionDate: 17-Jul-2002; LatestRevisionNote: Re-released for DXP Platform.; Publisher: Altium Limited
R37 R38 = Res3: Resistor; Published: 8-Jun-2000; LatestRevisionDate: 29-May-2009; LatestRevisionNote: IPC-7351 Footprint Added.; PackageReference: J1-0603; Publisher: Altium Limited; PackageDescription: Chip Resistor; Supplier 1: Mouser; Supplier Part Number 1: 660-RK73H1ETTP9101F
R46 R52 R63 = Res Semi: Semiconductor Resistor; Published: 8-Jun-2000; LatestRevisionDate: 17-Jul-2002; LatestRevisionNote: Re-released for DXP Platform.; PackageReference: AXIAL-0.5; Publisher: Altium Limited; PackageDescription: Axial Device, Thru-Hole; 2 Leads; 0.5 in Pin Spacing; Supplier 1: Mouser
  R46 R52: Supplier Part Number 1: 660-RK73B1ETTP361J
  R63: Supplier Part Number 1: 660-RK73Z1JTTDD
R62 = Inductor: Code_IEC: 1005; Published: 8-Jun-2000; LatestRevisionDate: 29-May-2009; LatestRevisionNote: IPC-7351 Footprint Added.; PackageReference: 0402-A; Publisher: Altium Limited; PackageDescription: Chip Inductor; Code_JEITA: 0402; Supplier 1: Mouser; Supplier Part Number 1: 660-RK73Z1ETTP
SW3 = SMT-PUSHBUTTON-SW: Pushbutton Switch - Long Button
U12 = LM3S5Y36: TI Stellaris LM3S5Y36 Microcontroller; Supplier 1: Mouser; Supplier Part Number 1: 595-LM3S5R36-IQR80C5
Y1 = XTAL: Crystal Oscillator; Published: 8-Jun-2000; LatestRevisionDate: 17-Jul-2002; LatestRevisionNote: Re-released for DXP Platform.; PackageReference: R38; Publisher: Altium Limited; PackageDescription: Crystal, Thru-Hole; 2 Leads; Body 3.1 x 8.2 mm (Dia.xH); Supplier 1: Mouser; Supplier Part Number 1: 717-7A-16.000MAAJ-T

## Sheet Whitespace_Daughtercard_spi_mux.SchDoc: Serial Interface MUXes
size A; Author: Ryan E. Guerra; Revision: 1.0; SheetNumber: 6; SheetTotal: 10
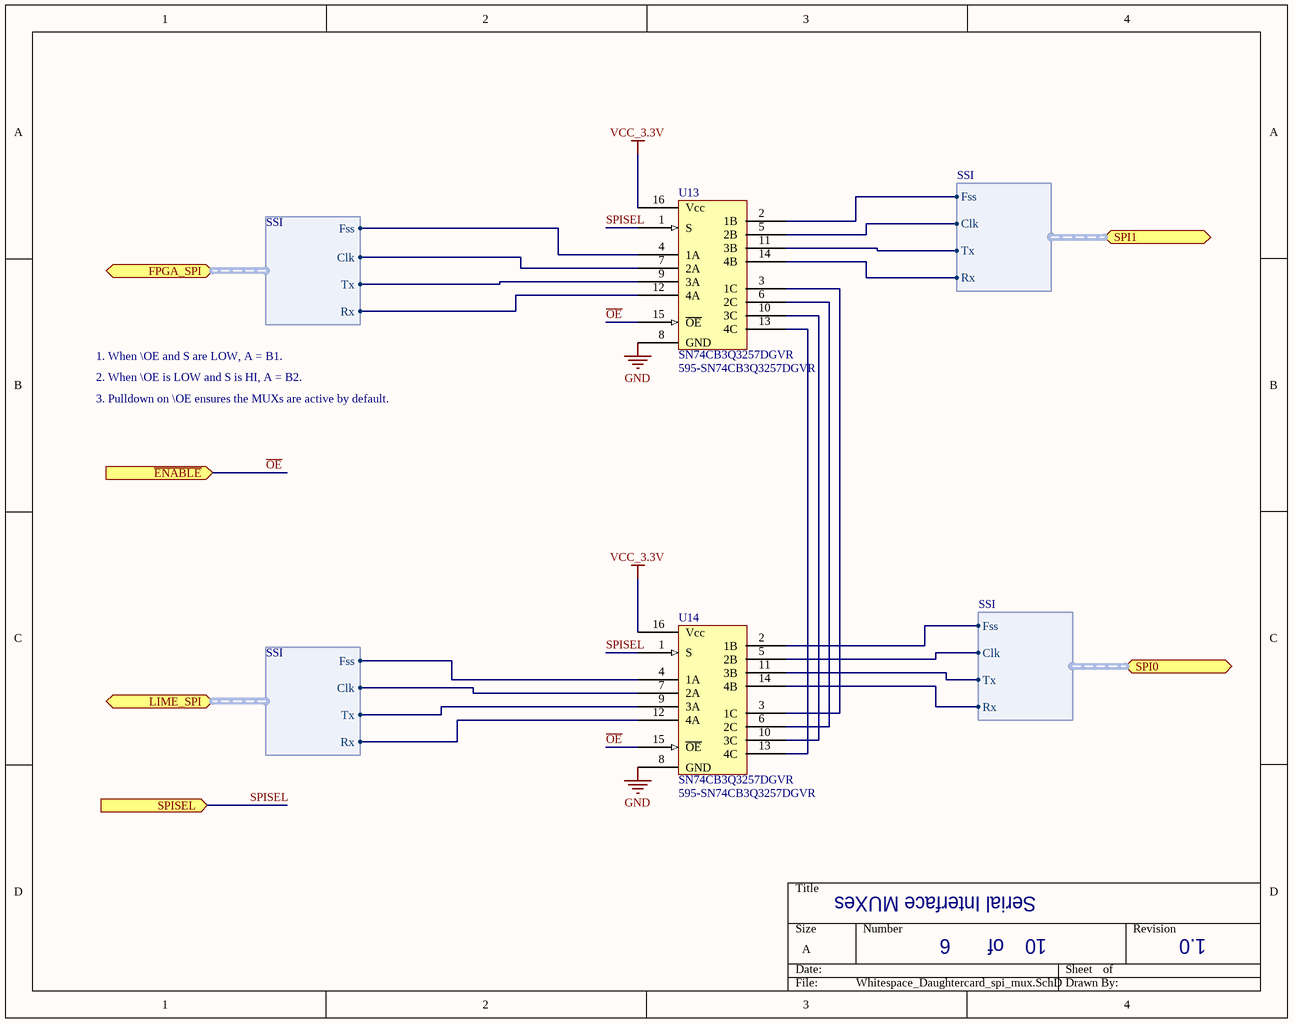
[diagram p14: Whitespace_Daughtercard_spi_mux.SchDoc]

### Parts
U13  SN74CB3Q3257DGVR  Supplier Part Number 1: 595-SN74CB3Q3257DGVR  [TVSOP16_v5]
U14  SN74CB3Q3257DGVR  Supplier Part Number 1: 595-SN74CB3Q3257DGVR  [TVSOP16_v5]

### Ports
FPGA_SPI (harness SSI), LIME_SPI (harness SSI), SPI0 (harness SSI), SPI1 (harness SSI), SPISEL (in), ~{ENABLE} (in)

### Harnesses
SSI: Fss, Clk, Tx, Rx

### Nets
GND: U13.8(GND) U14.8(GND)
VCC_3.3V: U13.16(Vcc) U14.16(Vcc)
~{OE}: U13.15(~{OE}) U14.15(~{OE}) ; port ~{ENABLE}  [project net ~{MUX_EN}]
MASTER_CLK: U14.7(2A) ; port LIME_SPI.Clk
MASTER_FSS: U14.4(1A) ; port LIME_SPI.Fss
MASTER_RX: U14.12(4A) ; port LIME_SPI.Rx
MASTER_TX: U14.9(3A) ; port LIME_SPI.Tx
PA2: U14.5(2B) ; port SPI0.Clk
PA3: U14.2(1B) ; port SPI0.Fss
PA4: U14.14(4B) ; port SPI0.Rx
PA5: U14.11(3B) ; port SPI0.Tx
PE0: U13.5(2B) ; port SPI1.Clk
PE1: U13.2(1B) ; port SPI1.Fss
PE2: U13.11(3B) ; port SPI1.Tx
PE3: U13.14(4B) ; port SPI1.Rx
SPI_CLK: U13.7(2A) ; port FPGA_SPI.Clk
SPI_FSS: U13.4(1A) ; port FPGA_SPI.Fss
SPI_RX: U13.12(4A) ; port FPGA_SPI.Rx
SPI_TX: U13.9(3A) ; port FPGA_SPI.Tx
SPISEL: U13.1(S) U14.1(S) ; port SPISEL
NetU13_3: U13.3(1C) U14.3(1C)
NetU13_6: U13.6(2C) U14.6(2C)
NetU13_10: U13.10(3C) U14.10(3C)
NetU13_13: U13.13(4C) U14.13(4C)

### Notes on the sheet
- 1. When \OE and S are LOW, A = B1.
- 2. When \OE is LOW and S is HI, A = B2.
- 3. Pulldown on \OE ensures the MUXs are active by default.
- of

### Library data of the parts
U13 U14 = SN74CB3Q3257DGVR: 4-bit MUX/DEMUX 1-of-2  0-5V SIG 3.3V CTRL TVSOP-16; Supplier 1: Mouser

## Sheet Whitespace_Daughtercard_notes.SchDoc: Misc. Project Notes
size A; Author: Ryan E. Guerra; Revision: 1.0; SheetNumber: 10; SheetTotal: 10
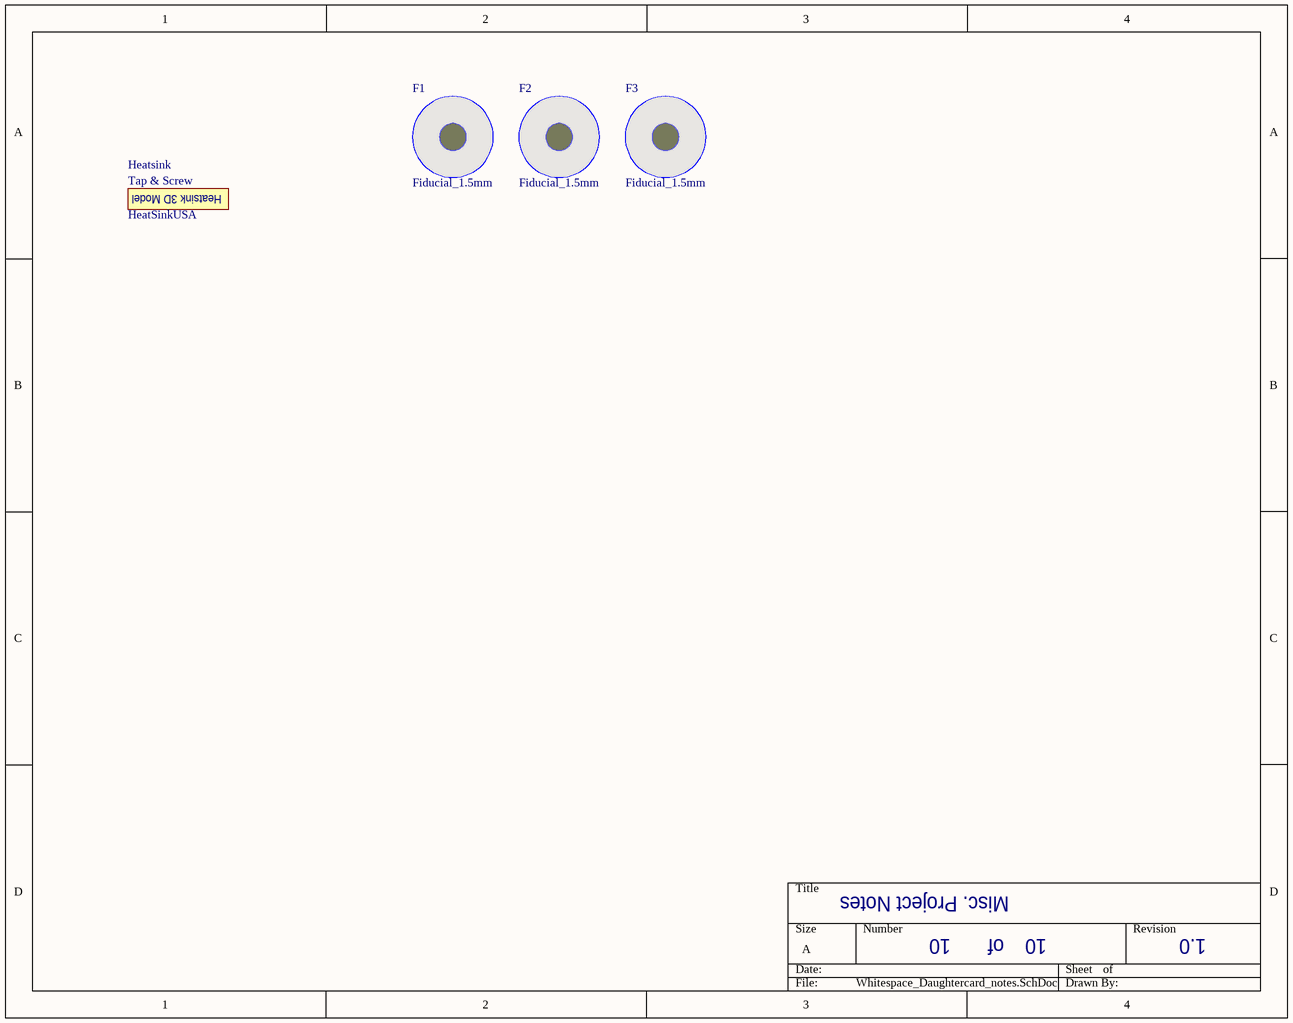
[diagram p15: Whitespace_Daughtercard_notes.SchDoc]

### Parts
F1  Fiducial_1.5mm  [1.5mm_FIDUCIAL_v4]
F2  Fiducial_1.5mm  [1.5mm_FIDUCIAL_v4]
F3  Fiducial_1.5mm  [1.5mm_FIDUCIAL_v4]
Heatsink  Tap & Screw  Supplier 1: HeatSinkUSA  [HeatSinkUSA_1800]

### Notes on the sheet
- of
- (in symbol HeatSink) Heatsink 3D Model

### Library data of the parts
Heatsink = HeatSink: Supplier Part Number 1: 1.813" Wide Extruded Aluminum Heatsink

## Nets that join several sheets
GND: Whitespace_Daughtercard_top_level (12 pins), Whitespace_Daughtercard_connector (25 pins), Whitespace_Daughtercard_pwr (62 pins), Whitespace_Daughtercard_xceiver (56 pins), Whitespace_Daughtercard_uhf (53 pins), Whitespace_Daughtercard_wifi (34 pins), Whitespace_Daughtercard_ucontroller (32 pins), Whitespace_Daughtercard_spi_mux (U13.8 U14.8)
HSMC_VADJ: Whitespace_Daughtercard_connector (J3.131 J3.133), Whitespace_Daughtercard_pwr (R59.1 R102.2)
VCC_3.3V: Whitespace_Daughtercard_top_level (7 pins), Whitespace_Daughtercard_connector (11 pins), Whitespace_Daughtercard_pwr (18 pins), Whitespace_Daughtercard_xceiver (12 pins), Whitespace_Daughtercard_uhf (7 pins), Whitespace_Daughtercard_wifi (7 pins), Whitespace_Daughtercard_ucontroller (17 pins), Whitespace_Daughtercard_spi_mux (U13.16 U14.16)
VCC_5V: Whitespace_Daughtercard_pwr (C45.1 FB23.2 R44.2 U3.3), Whitespace_Daughtercard_uhf (R4.2 R11.2 U5.4 U17.4), Whitespace_Daughtercard_wifi (6 pins)
VCC_7V: Whitespace_Daughtercard_pwr (C47.2 R43.2 U4.3), Whitespace_Daughtercard_uhf (R6.2 R7.2 U7.4)
VCC_12V: Whitespace_Daughtercard_connector (7 pins), Whitespace_Daughtercard_pwr (FB18.1 FB19.1 J2.2 R42.2)
VCC_USB: Whitespace_Daughtercard_top_level (FB21.2), Whitespace_Daughtercard_ucontroller (R62.1)
VREG_2.85V: Whitespace_Daughtercard_pwr (C135.2 IC4.5), Whitespace_Daughtercard_wifi (C67.2 IC3.5 IC3.6 IC3.7)
~{MUX_EN}: Whitespace_Daughtercard_top_level (R34.5 U10.15), Whitespace_Daughtercard_spi_mux (U13.15 U14.15)
~{RST}: Whitespace_Daughtercard_top_level (J12.1), Whitespace_Daughtercard_connector (J3.122), Whitespace_Daughtercard_ucontroller (C114.1 R38.1 SW3.2 U12.40)
CTRLSEL: Whitespace_Daughtercard_top_level (R34.6 U10.1), Whitespace_Daughtercard_connector (J3.121)
FPGA_UHF_ANT_CTRL: Whitespace_Daughtercard_top_level (U10.3), Whitespace_Daughtercard_connector (J3.104)
FPGA_UHF_PA2_CTRL: Whitespace_Daughtercard_top_level (U10.6), Whitespace_Daughtercard_connector (J3.103)
FPGA_WIFI_ANT_CTRL: Whitespace_Daughtercard_top_level (U10.10), Whitespace_Daughtercard_connector (J3.102)
FPGA_WIFI_PA_CTRL: Whitespace_Daughtercard_top_level (U10.13), Whitespace_Daughtercard_connector (J3.101)
MASTER_CLK: Whitespace_Daughtercard_xceiver (R26.1), Whitespace_Daughtercard_spi_mux (U14.7)
MASTER_FSS: Whitespace_Daughtercard_xceiver (R26.4), Whitespace_Daughtercard_spi_mux (U14.4)
MASTER_RX: Whitespace_Daughtercard_xceiver (R26.2), Whitespace_Daughtercard_spi_mux (U14.12)
MASTER_TX: Whitespace_Daughtercard_xceiver (R26.3), Whitespace_Daughtercard_spi_mux (U14.9)
NMI: Whitespace_Daughtercard_connector (J3.119), Whitespace_Daughtercard_ucontroller (U12.55)
PA0: Whitespace_Daughtercard_connector (J3.91), Whitespace_Daughtercard_ucontroller (J10.2 U12.17)
PA1: Whitespace_Daughtercard_connector (J3.89), Whitespace_Daughtercard_ucontroller (J10.1 U12.18)
PA2: Whitespace_Daughtercard_ucontroller (U12.19), Whitespace_Daughtercard_spi_mux (U14.5)
PA3: Whitespace_Daughtercard_ucontroller (U12.20), Whitespace_Daughtercard_spi_mux (U14.2)
PA4: Whitespace_Daughtercard_ucontroller (U12.21), Whitespace_Daughtercard_spi_mux (U14.14)
PA5: Whitespace_Daughtercard_ucontroller (U12.22), Whitespace_Daughtercard_spi_mux (U14.11)
PB0: Whitespace_Daughtercard_connector (J3.107), Whitespace_Daughtercard_ucontroller (U12.41)
PB1: Whitespace_Daughtercard_connector (J3.108), Whitespace_Daughtercard_ucontroller (U12.42)
PB2: Whitespace_Daughtercard_connector (J3.109), Whitespace_Daughtercard_ucontroller (R62.2 U12.47)
PB3: Whitespace_Daughtercard_connector (J3.110), Whitespace_Daughtercard_ucontroller (R63.2 U12.27)
PB4: Whitespace_Daughtercard_connector (J3.113), Whitespace_Daughtercard_ucontroller (U12.58)
PB5: Whitespace_Daughtercard_connector (J3.114), Whitespace_Daughtercard_uhf (R53.2 U17.5), Whitespace_Daughtercard_ucontroller (U12.57)
PB6: Whitespace_Daughtercard_connector (J3.115), Whitespace_Daughtercard_ucontroller (U12.56)
PC4: Whitespace_Daughtercard_top_level (U10.2), Whitespace_Daughtercard_ucontroller (U12.11)
PC5: Whitespace_Daughtercard_top_level (U10.5), Whitespace_Daughtercard_ucontroller (U12.14)
PC6: Whitespace_Daughtercard_top_level (U10.11), Whitespace_Daughtercard_ucontroller (U12.15)
PC7: Whitespace_Daughtercard_top_level (U10.14), Whitespace_Daughtercard_ucontroller (U12.16)
PD2: Whitespace_Daughtercard_wifi (R13.2), Whitespace_Daughtercard_ucontroller (U12.63)
PE0: Whitespace_Daughtercard_ucontroller (U12.6), Whitespace_Daughtercard_spi_mux (U13.5)
PE1: Whitespace_Daughtercard_ucontroller (U12.5), Whitespace_Daughtercard_spi_mux (U13.2)
PE2: Whitespace_Daughtercard_ucontroller (U12.2), Whitespace_Daughtercard_spi_mux (U13.11)
PE3: Whitespace_Daughtercard_ucontroller (U12.1), Whitespace_Daughtercard_spi_mux (U13.14)
PE4: Whitespace_Daughtercard_xceiver (R17.5), Whitespace_Daughtercard_uhf (U5.5), Whitespace_Daughtercard_ucontroller (U12.8)
PLL_CLK_OUT: Whitespace_Daughtercard_connector (J3.40), Whitespace_Daughtercard_xceiver (U1.41)
PLLCLK: Whitespace_Daughtercard_connector (J3.39), Whitespace_Daughtercard_xceiver (R12.2 R36.2)
RX_CLK: Whitespace_Daughtercard_connector (J3.95), Whitespace_Daughtercard_xceiver (R21.3)
RX_CLK_OUT: Whitespace_Daughtercard_connector (J3.120), Whitespace_Daughtercard_xceiver (U1.40)
RX_EN: Whitespace_Daughtercard_connector (J3.77), Whitespace_Daughtercard_xceiver (R16.7 U1.76)
RX_IQ_SEL: Whitespace_Daughtercard_connector (J3.79), Whitespace_Daughtercard_xceiver (R21.4)
RXD0: Whitespace_Daughtercard_connector (J3.41), Whitespace_Daughtercard_xceiver (R22.1)
RXD1: Whitespace_Daughtercard_connector (J3.43), Whitespace_Daughtercard_xceiver (R22.2)
RXD2: Whitespace_Daughtercard_connector (J3.47), Whitespace_Daughtercard_xceiver (R22.3)
RXD3: Whitespace_Daughtercard_connector (J3.49), Whitespace_Daughtercard_xceiver (R23.1)
RXD4: Whitespace_Daughtercard_connector (J3.53), Whitespace_Daughtercard_xceiver (R22.4)
RXD5: Whitespace_Daughtercard_connector (J3.55), Whitespace_Daughtercard_xceiver (R23.3)
RXD6: Whitespace_Daughtercard_connector (J3.59), Whitespace_Daughtercard_xceiver (R23.2)
RXD7: Whitespace_Daughtercard_connector (J3.61), Whitespace_Daughtercard_xceiver (R23.4)
RXD8: Whitespace_Daughtercard_connector (J3.65), Whitespace_Daughtercard_xceiver (R24.1)
RXD9: Whitespace_Daughtercard_connector (J3.67), Whitespace_Daughtercard_xceiver (R24.2)
RXD10: Whitespace_Daughtercard_connector (J3.71), Whitespace_Daughtercard_xceiver (R24.3)
RXD11: Whitespace_Daughtercard_connector (J3.73), Whitespace_Daughtercard_xceiver (R24.4)
SPI_CLK: Whitespace_Daughtercard_connector (J3.90), Whitespace_Daughtercard_spi_mux (U13.7)
SPI_FSS: Whitespace_Daughtercard_connector (J3.84), Whitespace_Daughtercard_spi_mux (U13.4)
SPI_RX: Whitespace_Daughtercard_connector (J3.86), Whitespace_Daughtercard_spi_mux (U13.12)
SPI_TX: Whitespace_Daughtercard_connector (J3.85), Whitespace_Daughtercard_spi_mux (U13.9)
SPISEL: Whitespace_Daughtercard_top_level (R34.7), Whitespace_Daughtercard_connector (J3.92), Whitespace_Daughtercard_spi_mux (U13.1 U14.1)
TCK: Whitespace_Daughtercard_top_level (J12.4 R35.8), Whitespace_Daughtercard_connector (R54.1), Whitespace_Daughtercard_ucontroller (U12.52)
TDI: Whitespace_Daughtercard_top_level (J12.2 R35.6), Whitespace_Daughtercard_connector (R55.1), Whitespace_Daughtercard_ucontroller (U12.50)
TDO: Whitespace_Daughtercard_top_level (J12.3 R35.5), Whitespace_Daughtercard_connector (R56.1), Whitespace_Daughtercard_ucontroller (U12.49)
TMS: Whitespace_Daughtercard_top_level (J12.5 R35.7), Whitespace_Daughtercard_connector (R57.1), Whitespace_Daughtercard_ucontroller (U12.51)
TRX_RESET: Whitespace_Daughtercard_connector (J3.83), Whitespace_Daughtercard_xceiver (R25.2), Whitespace_Daughtercard_ucontroller (R63.1)
TX_CLK: Whitespace_Daughtercard_connector (J3.96), Whitespace_Daughtercard_xceiver (R21.1)
TX_EN: Whitespace_Daughtercard_connector (J3.78), Whitespace_Daughtercard_xceiver (R16.5 U1.66)
TX_IQ_SEL: Whitespace_Daughtercard_connector (J3.80), Whitespace_Daughtercard_xceiver (R21.2)
TXD0: Whitespace_Daughtercard_connector (J3.42), Whitespace_Daughtercard_xceiver (R18.4)
TXD1: Whitespace_Daughtercard_connector (J3.44), Whitespace_Daughtercard_xceiver (R18.3)
TXD2: Whitespace_Daughtercard_connector (J3.48), Whitespace_Daughtercard_xceiver (R18.2)
TXD3: Whitespace_Daughtercard_connector (J3.50), Whitespace_Daughtercard_xceiver (R18.1)
TXD4: Whitespace_Daughtercard_connector (J3.54), Whitespace_Daughtercard_xceiver (R19.4)
TXD5: Whitespace_Daughtercard_connector (J3.56), Whitespace_Daughtercard_xceiver (R19.3)
TXD6: Whitespace_Daughtercard_connector (J3.60), Whitespace_Daughtercard_xceiver (R19.2)
TXD7: Whitespace_Daughtercard_connector (J3.62), Whitespace_Daughtercard_xceiver (R19.1)
TXD8: Whitespace_Daughtercard_connector (J3.66), Whitespace_Daughtercard_xceiver (R20.4)
TXD9: Whitespace_Daughtercard_connector (J3.68), Whitespace_Daughtercard_xceiver (R20.2)
TXD10: Whitespace_Daughtercard_connector (J3.72), Whitespace_Daughtercard_xceiver (R20.3)
TXD11: Whitespace_Daughtercard_connector (J3.74), Whitespace_Daughtercard_xceiver (R20.1)
UHF_ANT_1: Whitespace_Daughtercard_xceiver (L12.1), Whitespace_Daughtercard_uhf (C58.2)
UHF_ANT_2: Whitespace_Daughtercard_xceiver (L14.1), Whitespace_Daughtercard_uhf (C59.1)
UHF_ANT_CTRL: Whitespace_Daughtercard_top_level (U10.4), Whitespace_Daughtercard_xceiver (R16.1), Whitespace_Daughtercard_uhf (C60.2 SW1.5 U9.2)
UHF_BB_RX_n: Whitespace_Daughtercard_xceiver (U1.98), Whitespace_Daughtercard_uhf (C63.1 T2.3)
UHF_BB_RX_p: Whitespace_Daughtercard_xceiver (U1.96), Whitespace_Daughtercard_uhf (C63.2 T2.1)
UHF_BB_TX_n: Whitespace_Daughtercard_xceiver (U1.50), Whitespace_Daughtercard_uhf (T1.3)
UHF_BB_TX_p: Whitespace_Daughtercard_xceiver (U1.48), Whitespace_Daughtercard_uhf (T1.1)
UHF_PA2_CTRL: Whitespace_Daughtercard_top_level (U10.7), Whitespace_Daughtercard_xceiver (R17.6), Whitespace_Daughtercard_uhf (U7.5)
UHF_POSTEXTLNA_n: Whitespace_Daughtercard_xceiver (U1.94), Whitespace_Daughtercard_uhf (C123.1 T6.3)
UHF_POSTEXTLNA_p: Whitespace_Daughtercard_xceiver (U1.92), Whitespace_Daughtercard_uhf (C123.2 T6.1)
USB0D_N: Whitespace_Daughtercard_top_level (J11.2), Whitespace_Daughtercard_ucontroller (U12.45)
USB0D_P: Whitespace_Daughtercard_top_level (J11.3), Whitespace_Daughtercard_ucontroller (U12.46)
WIFI_ANT_1: Whitespace_Daughtercard_xceiver (D12.2 J6.1), Whitespace_Daughtercard_wifi (C69.2)
WIFI_ANT_2: Whitespace_Daughtercard_xceiver (D13.2 J7.1), Whitespace_Daughtercard_wifi (C70.2)
WIFI_ANT_CTRL: Whitespace_Daughtercard_top_level (U10.9), Whitespace_Daughtercard_xceiver (R17.7), Whitespace_Daughtercard_wifi (C71.2 SW2.5 U15.2)
WIFI_BB_RX_N: Whitespace_Daughtercard_xceiver (U1.102), Whitespace_Daughtercard_wifi (T4.3)
WIFI_BB_RX_P: Whitespace_Daughtercard_xceiver (U1.100), Whitespace_Daughtercard_wifi (T4.1)
WIFI_BB_TX_N: Whitespace_Daughtercard_xceiver (U1.46), Whitespace_Daughtercard_wifi (T3.3)
WIFI_BB_TX_P: Whitespace_Daughtercard_xceiver (U1.44), Whitespace_Daughtercard_wifi (T3.1)
WIFI_PA_CTRL: Whitespace_Daughtercard_top_level (U10.12), Whitespace_Daughtercard_xceiver (R17.8), Whitespace_Daughtercard_wifi (IC3.8 IC3.20 U16.2)

## Assembly variants
Default Variant: not fitted C97 C165 C166 C168 R54 R55 R56 R57 R59 R62 R63 R103 SW3
No Alt RFIn: not fitted C54 C97 C121 C123 C124 C125 C126 C165 C166 C168 L16 R54 R55 R56 R57 R59 R62 R63 R103 SW3 T6